# EasyEDA Pro project BLDCv5.eprj

# Schematic Schematic1
Create Date: 2024-09-21; Page Name: P1; Project Name: BLDCv5; Schematic Name: Schematic1; Update Date: 2024-09-21; Company: EasyEDA.com; Drawn: EasyEDA; Page Size: A4; Part Number: JLCPCB-002; Reviewed: EasyEDA; Version: V0.1
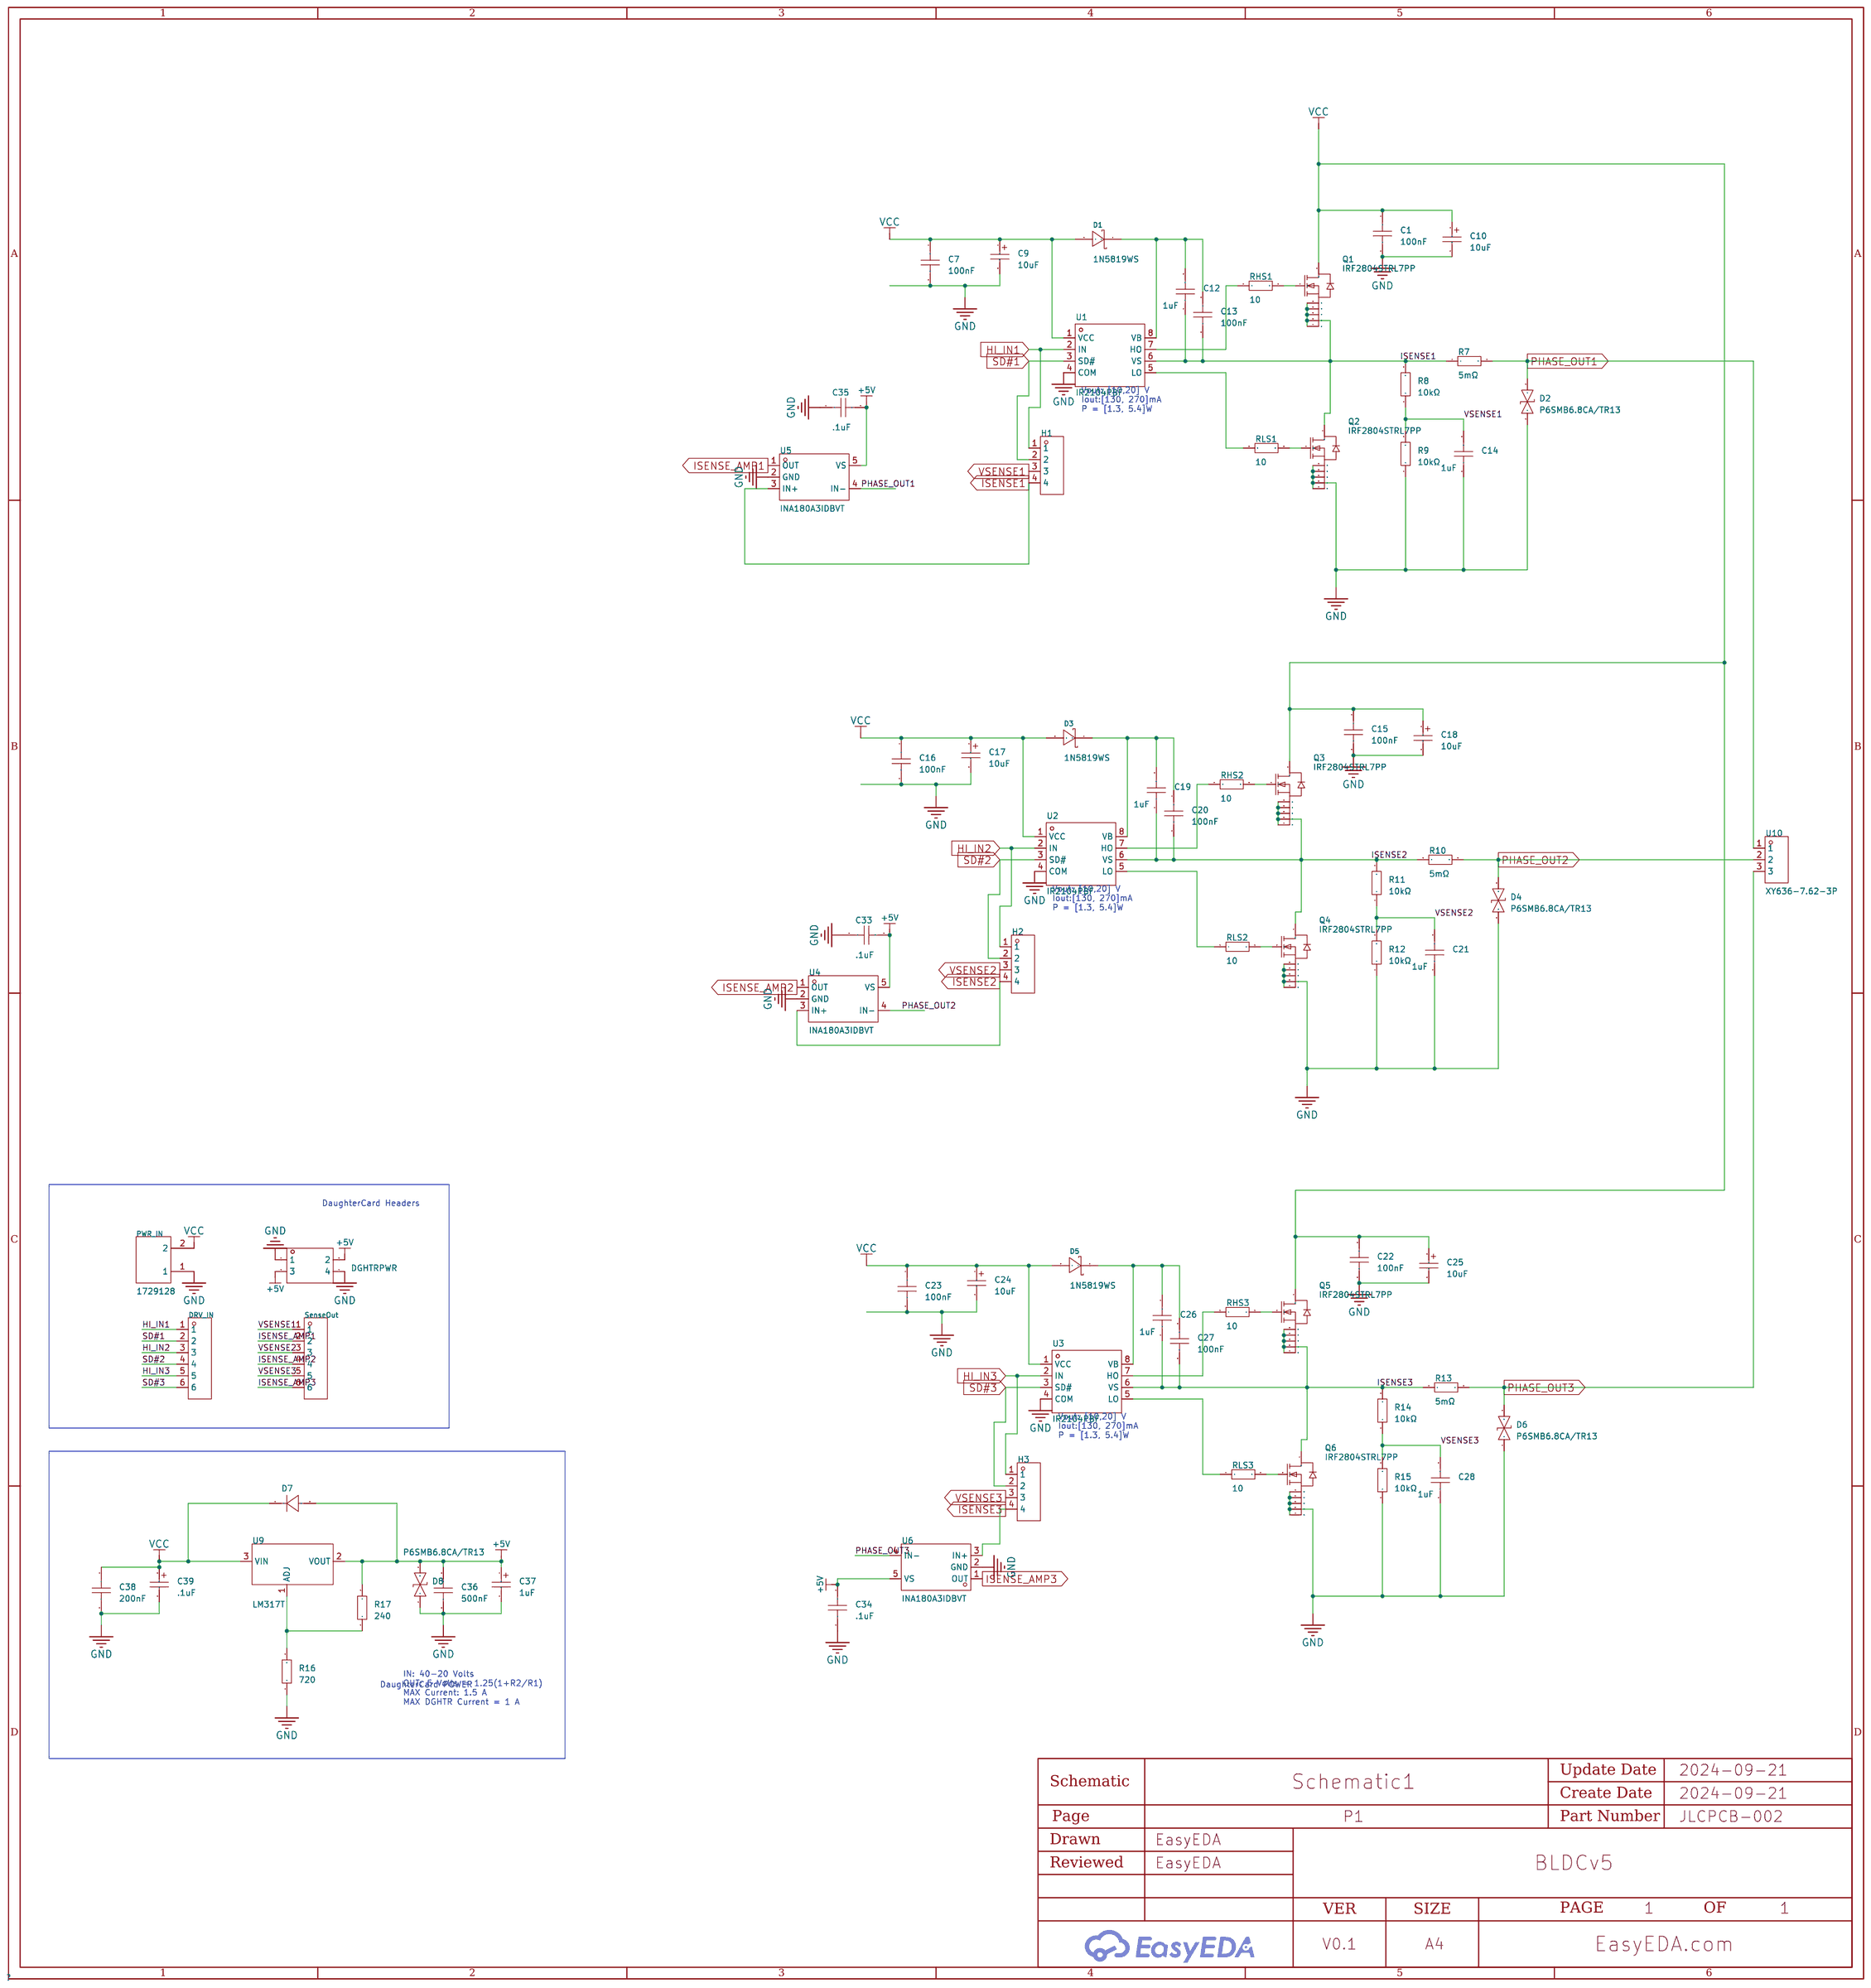
[diagram p0: schematic sheet]

## Parts
C1  100nF  [C0603]
C7  100nF  [C0603]
C9  10uF  [CAP-SMD_BD5.0-L5.3-W5.3-LS6.3-FD]
C10  10uF  [CAP-SMD_BD5.0-L5.3-W5.3-LS6.3-FD]
C12  1uF  [CAP-TH_L7.2-W2.5-P5.00-D0.6]
C13  100nF  [C0603]
C14  1uF  [CAP-TH_L7.2-W2.5-P5.00-D0.6]
C15  100nF  [C0603]
C16  100nF  [C0603]
C17  10uF  [CAP-SMD_BD5.0-L5.3-W5.3-LS6.3-FD]
C18  10uF  [CAP-SMD_BD5.0-L5.3-W5.3-LS6.3-FD]
C19  1uF  [CAP-TH_L7.2-W2.5-P5.00-D0.6]
C20  100nF  [C0603]
C21  1uF  [CAP-TH_L7.2-W2.5-P5.00-D0.6]
C22  100nF  [C0603]
C23  100nF  [C0603]
C24  10uF  [CAP-SMD_BD5.0-L5.3-W5.3-LS6.3-FD]
C25  10uF  [CAP-SMD_BD5.0-L5.3-W5.3-LS6.3-FD]
C26  1uF  [CAP-TH_L7.2-W2.5-P5.00-D0.6]
C27  100nF  [C0603]
C28  1uF  [CAP-TH_L7.2-W2.5-P5.00-D0.6]
C33  .1uF  [C0402]
C34  .1uF  [C0402]
C35  .1uF  [C0402]
C36  500nF  [C0603]
C37  1uF  [CAP-SMD_BD5.0-L5.3-W5.3-LS6.3-FD]
C38  200nF  [C0603]
C39  .1uF  [CAP-SMD_BD5.0-L5.3-W5.3-LS6.3-FD]
D1  1N5819WS  [SOD-323_L1.8-W1.3-LS2.5-RD]
D2  P6SMB6.8CA/TR13  [SMB_L4.6-W3.6-LS5.3-BI]
D3  1N5819WS  [SOD-323_L1.8-W1.3-LS2.5-RD]
D4  P6SMB6.8CA/TR13  [SMB_L4.6-W3.6-LS5.3-BI]
D5  1N5819WS  [SOD-323_L1.8-W1.3-LS2.5-RD]
D6  P6SMB6.8CA/TR13  [SMB_L4.6-W3.6-LS5.3-BI]
D7  -  [DO-41_BD2.4-L4.7-P8.70-D0.9-RD]
D8  P6SMB6.8CA/TR13  [SMB_L4.6-W3.6-LS5.3-BI]
DGHTRPWR  -  [HDR-TH_4P-P2.54-V-F-R2-C2-S2.54]
DRV_IN  -  [HDR-TH_6P-P2.54-V-F]
H1  -  [HDR-TH_4P-P2.54-V-M]
H2  -  [HDR-TH_4P-P2.54-V-M]
H3  -  [HDR-TH_4P-P2.54-V-M]
PWR_IN  1729128  [CONN-TH_2P-P5.08]
Q1  IRF2804STRL7PP  [D2PAK-7_L10.6-W9.6-P1.27-LS15.9-BR]
Q2  IRF2804STRL7PP  [D2PAK-7_L10.6-W9.6-P1.27-LS15.9-BR]
Q3  IRF2804STRL7PP  [D2PAK-7_L10.6-W9.6-P1.27-LS15.9-BR]
Q4  IRF2804STRL7PP  [D2PAK-7_L10.6-W9.6-P1.27-LS15.9-BR]
Q5  IRF2804STRL7PP  [D2PAK-7_L10.6-W9.6-P1.27-LS15.9-BR]
Q6  IRF2804STRL7PP  [D2PAK-7_L10.6-W9.6-P1.27-LS15.9-BR]
R7  5mΩ  [R2512]
R8  10kΩ  [RES-TH_BD3.3-L9.0-P13.00-D0.6]
R9  10kΩ  [RES-TH_BD3.3-L9.0-P13.00-D0.6]
R10  5mΩ  [R2512]
R11  10kΩ  [RES-TH_BD3.3-L9.0-P13.00-D0.6]
R12  10kΩ  [RES-TH_BD3.3-L9.0-P13.00-D0.6]
R13  5mΩ  [R2512]
R14  10kΩ  [RES-TH_BD3.3-L9.0-P13.00-D0.6]
R15  10kΩ  [RES-TH_BD3.3-L9.0-P13.00-D0.6]
R16  720  [RES-TH_BD3.3-L9.0-P13.00-D0.6]
R17  240  [RES-TH_BD3.3-L9.0-P13.00-D0.6]
RHS1  10  [R1210]
RHS2  10  [R1210]
RHS3  10  [R1210]
RLS1  10  [R1210]
RLS2  10  [R1210]
RLS3  10  [R1210]
SenseOut  -  [HDR-TH_6P-P2.54-V-F]
U1  IR2104PBF  [DIP-8_L9.9-W6.6-P2.54-LS7.62-BL]
U2  IR2104PBF  [DIP-8_L9.9-W6.6-P2.54-LS7.62-BL]
U3  IR2104PBF  [DIP-8_L9.9-W6.6-P2.54-LS7.62-BL]
U4  INA180A3IDBVT  [SOT-23-5_L2.9-W1.6-P0.95-LS2.8-TL]
U5  INA180A3IDBVT  [SOT-23-5_L2.9-W1.6-P0.95-LS2.8-TL]
U6  INA180A3IDBVT  [SOT-23-5_L2.9-W1.6-P0.95-LS2.8-TL]
U9  LM317T  [TO-220-3_L10.0-W4.6-P2.54-L]
U10  XY636-7.62-3P  [CONN-TH_XY636-7.62-3P]

## Library data of the parts
C1 C7 C13 C15 C16 C20 C22 C23 C27 C36 C38 = CAP_0603: Supplier Footprint: 0603
C9 C10 C17 C18 C24 C25 C37 C39 = C_Ele_SMD_5x5.4mm: Supplier Footprint: SMD,5x5.4mm
C12 C14 C19 C21 C26 C28 = SMEC334J100M2: Capacitance: Tolerance:±5% Tolerance:±5% Voltage Rated:; LCSC Part Name: 330nF ±5% 100V; Supplier Part: C401104; Manufacturer: CHAMPION(全鹏); Supplier Footprint: 插件,P=5mm; JLCPCB Part Class: Extended Part; Datasheet: https://atta.szlcsc.com/upload/public/pdf/source/20190730/C401104_3330673C3D333BC9993FC47731C2A492.pdf; Supplier: LCSC; Tolerance: ±5%
C33-C35 = CAP_0402: Supplier Part: C1525; Supplier Footprint: 0402
D1 D3 D5 = 1N5819WS_C191023: Forward Voltage (Vf@If):600mV@1A Reverse Voltage (Vr):40V Average Rectified Current (Io):1A; LCSC Part Name: 电压:40V 电流:1A; Supplier Part: C191023; Manufacturer: Hottech(合科泰); Supplier Footprint: SOD-323; JLCPCB Part Class: Basic Part; Datasheet: https://atta.szlcsc.com/upload/public/pdf/source/20220428/3CB86FD8D28D653594B4E35F9D5AEFD9.pdf; Supplier: LCSC; Forward Voltage (Vf@If): 600mV@1A; Reverse Voltage (Vr): 40V; Average Rectified Current (Io): 1A
D2 D4 D6 D8 = P6SMB6.8CA/TR13: Reverse Stand-Off Voltage (Vrwm):5.8V Maximum Clamping Voltage:10.5V Peak Pulse Current (Ipp)@10/1000us:58.1A Peak Pulse Power Dissipation (Ppp)@10/1000us:600W Breakdown Voltage:6.45V Type:TVS; Supplier Part: C78395; Manufacturer: Brightking(君耀电子); Supplier Footprint: SMB(DO-214AA); JLCPCB Part Class: Basic Part; Datasheet: https://atta.szlcsc.com/upload/public/pdf/source/20160709/1468031879762.pdf; Supplier: LCSC; Reverse Stand-Off Voltage (Vrwm): 5.8V; Maximum Clamping Voltage: 10.5V; Peak Pulse Current (Ipp)@10/1000us: 58.1A; Peak Pulse Power Dissipation (Ppp)@10/1000us: 600W; Breakdown Voltage: 6.45V; Type: TVS
D7 = 1N4007: Supplier Footprint: DO-41
DGHTRPWR = HDR-F-2.54_2x2: Supplier Footprint: Through
DRV_IN SenseOut = HDR-F_2.54_1x6P: Supplier Footprint: Through
H1-H3 = HDR-M_2.54_1x4P: Supplier Footprint: Through
PWR_IN = 1729128: Structure:1x2P Pitch:5.08mm Color:Green Mounting Style:Straight Current Rating (Max):13.5A Voltage Rating (Max):400V Number of Pins:2P Number of Rows:1 Wire Gauge - AWG:14~30 Wire Gauge - AWG:14~30 Number of PINs Per Row:2 Operating Temperature Range:- Op; LCSC Part Name: 停产; Supplier Part: C91153; Manufacturer: Phoenix Contact(菲尼克斯); Supplier Footprint: 插件,P=5.08mm; JLCPCB Part Class: Extended Part; Datasheet: https://atta.szlcsc.com/upload/public/pdf/source/20161226/1482720163948.pdf; Supplier: LCSC; Structure: 1x2P; Pitch: 5.08mm; Color: Green; Mounting Style: Straight; Current Rating (Max): 13.5A; Voltage Rating (Max): 400V; Number of Pins: 2P; Number of Rows: 1; Wire Gauge - AWG: 14~30; Number of PINs Per Row: 2
Q1-Q6 = IRF2804STRL7PP: Supplier Part: C459950; Manufacturer: Infineon(英飞凌); Supplier Footprint: TO-252-3; JLCPCB Part Class: Extended Part; Datasheet: https://atta.szlcsc.com/upload/public/pdf/source/20211220/39CD65D483719D465F1A88FFAD2C5DF5.pdf; Supplier: LCSC
R7 R10 R13 = PA2512FKF7W0R005E: Type:Current Sensing Resistors Resistance: Tolerance:±1% Tolerance:±1% Power(Watts): Temperature Coefficient:±100ppm/℃ Temperature Coefficient:±100ppm/℃; LCSC Part Name: 5mΩ ±1% 2W; Supplier Part: C309526; Manufacturer: YAGEO(国巨); Supplier Footprint: 2512; JLCPCB Part Class: Extended Part; Datasheet: https://atta.szlcsc.com/upload/public/pdf/source/20190227/C375693_219964CC8B3EBD36DBDF701587FA5938.pdf; Supplier: LCSC; Type: Current Sensing Resistors; Tolerance: ±1%; Temperature Coefficient: ±100ppm/℃
R8 R9 R11 R12 R14-R17 = Res_AXIAL-1/2W: Supplier Footprint: Through
RHS1-RHS3 RLS1-RLS3 = Res_1210: Supplier Footprint: 1210
U1-U3 = IR2104PBF: Driven Configuration:Half Bridge Load Type:MOSFET；IGBT Number of Drivers:2 Peak Output Current(sink):360mA Peak Output Current(source):210mA Supply Voltage:10V~20V Supply Voltage:10V~20V Rise Time:100ns Fall Time:50ns Operating Temperature:-40℃~+150℃@(Tj); LCSC Part Name: IR2104PBF 停产; Supplier Part: C2959; Manufacturer: Infineon(英飞凌); Supplier Footprint: PDIP-8; JLCPCB Part Class: Extended Part; Datasheet: https://atta.szlcsc.com/upload/public/pdf/source/20140906/1457707236579.pdf; Supplier: LCSC; Driven Configuration: Half Bridge; Load Type: MOSFET；IGBT; Number of Drivers: 2; Peak Output Current(sink): 360mA; Peak Output Current(source): 210mA; Supply Voltage: 10V~20V; Rise Time: 100ns; Fall Time: 50ns; Operating Temperature: -40℃~+150℃@(Tj)
U4-U6 = INA180A3IDBVT: Number of Channels:单路 Supply Current:260uA Operating Temperature:-40℃~+125℃ Operating Temperature:-40℃~+125℃; Supplier Part: C2877844; Manufacturer: TI(德州仪器); Supplier Footprint: SOT-23-5; JLCPCB Part Class: Extended Part; Datasheet: https://www.ti.com/cn/lit/gpn/ina180; Supplier: LCSC; Number of Channels: 单路; Supply Current: 260uA; Operating Temperature: -40℃~+125℃
U9 = LM317T_C5444279: Output Type:可调 Maximum Input Voltage:40V Output Voltage:1.7V~37V Output Voltage:1.7V~37V MAX Output Current:1.5A Output Polarity:Positive electrode Number of Outputs:1; Supplier Part: C5444279; Manufacturer: Siproin(上海矽朋); Supplier Footprint: TO-220; JLCPCB Part Class: Extended Part; Datasheet: https://atta.szlcsc.com/upload/public/pdf/source/20230412/703E44E72FEA4765420A69E1CD3AD9D7.pdf; Supplier: LCSC; Output Type: 可调; Maximum Input Voltage: 40V; Output Voltage: 1.7V~37V; MAX Output Current: 1.5A; Output Polarity: Positive electrode; Number of Outputs: 1
U10 = XY636-7.62-3P: Structure:1x3P Pitch:7.62mm Color:Green Mounting Style:Straight Current Rating (Max):30A Voltage Rating (Max):300V Number of Pins:3P Number of Rows:1 Wire Gauge - AWG:10~26 Wire Gauge - AWG:10~26 Wire Gauge - mm2:4 Wire Gauge - mm2:4 Number of PINs Per Ro; LCSC Part Name: 1x3P 7.62mm 直插 排数:1 每排P数:3; Supplier Part: C880593; Manufacturer: XINLAIYA(新莱亚); Supplier Footprint: 插件,P=7.62mm; JLCPCB Part Class: Extended Part; Datasheet: https://atta.szlcsc.com/upload/public/pdf/source/20201013/C880593_D39E4D9453281D8A65D8CBDFFFF89DB3.pdf; Supplier: LCSC; Structure: 1x3P; Pitch: 7.62mm; Color: Green; Mounting Style: Straight; Current Rating (Max): 30A; Voltage Rating (Max): 300V; Number of Pins: 3P; Number of Rows: 1; Wire Gauge - AWG: 10~26; Wire Gauge - mm2: 4; Number of PINs Per Row: 3; Contact Material: Copper; Contact Plating: Tin; Screw Specification: M3

## Nets
+5V: C33.2 C34.2 C35.2 C36.1 C37.1 D7.2(A) D8.2 DGHTRPWR.2 DGHTRPWR.3 R17.2 U4.5(VS) U5.5(VS) U6.5(VS) U9.2(VOUT)
GND: C1.2 C7.2 C9.2 C10.2 C14.1 C15.2 C16.2 C17.2 C18.2 C21.1 C22.2 C23.2 C24.2 C25.2 C28.1 C33.1 C34.1 C35.1 C36.2 C37.2 C38.2 C39.2 D2.1 D4.1 D6.1 D8.1 DGHTRPWR.1 DGHTRPWR.4 PWR_IN.1 Q2.2(S) Q2.3(S) Q2.5(S) Q2.6(S) Q2.7(S) Q4.2(S) Q4.3(S) Q4.5(S) Q4.6(S) Q4.7(S) Q6.2(S) Q6.3(S) Q6.5(S) Q6.6(S) Q6.7(S) R9.1 R12.1 R15.1 R16.1 U1.4(COM) U2.4(COM) U3.4(COM) U4.2(GND) U5.2(GND) U6.2(GND)
VCC: C1.1 C7.1 C9.1 C10.1 C15.1 C16.1 C17.1 C18.1 C22.1 C23.1 C24.1 C25.1 C38.1 C39.1 D1.2(A) D3.2(A) D5.2(A) D7.1(K) PWR_IN.2 Q1.4(D) Q3.4(D) Q5.4(D) U1.1(VCC) U2.1(VCC) U3.1(VCC) U9.3(VIN)
HI_IN1: DRV_IN.1 H1.1 U1.2(IN)
HI_IN2: DRV_IN.3 H2.1 U2.2(IN)
HI_IN3: DRV_IN.5 H3.1 U3.2(IN)
ISENSE1: C12.1 C13.2 H1.4 Q1.2(S) Q1.3(S) Q1.5(S) Q1.6(S) Q1.7(S) Q2.4(D) R7.1 R8.2 U1.6(VS) U5.3(IN+)
ISENSE2: C19.1 C20.2 H2.4 Q3.2(S) Q3.3(S) Q3.5(S) Q3.6(S) Q3.7(S) Q4.4(D) R10.1 R11.2 U2.6(VS) U4.3(IN+)
ISENSE3: C26.1 C27.2 H3.4 Q5.2(S) Q5.3(S) Q5.5(S) Q5.6(S) Q5.7(S) Q6.4(D) R13.1 R14.2 U3.6(VS) U6.3(IN+)
ISENSE_AMP1: SenseOut.2 U5.1(OUT)
ISENSE_AMP2: SenseOut.4 U4.1(OUT)
ISENSE_AMP3: SenseOut.6 U6.1(OUT)
PHASE_OUT1: D2.2 R7.2 U5.4(IN-) U10.1
PHASE_OUT2: D4.2 R10.2 U4.4(IN-) U10.2
PHASE_OUT3: D6.2 R13.2 U6.4(IN-) U10.3
SD#1: DRV_IN.2 H1.2 U1.3(SD#)
SD#2: DRV_IN.4 H2.2 U2.3(SD#)
SD#3: DRV_IN.6 H3.2 U3.3(SD#)
VSENSE1: C14.2 H1.3 R8.1 R9.2 SenseOut.1
VSENSE2: C21.2 H2.3 R11.1 R12.2 SenseOut.3
VSENSE3: C28.2 H3.3 R14.1 R15.2 SenseOut.5
$1N695: RHS1.1 U1.7(HO)
$1N696: Q1.1(G) RHS1.2
$1N697: RLS1.1 U1.5(LO)
$1N698: Q2.1(G) RLS1.2
$1N719: C12.2 C13.1 D1.1(K) U1.8(VB)
$1N1386: RHS2.1 U2.7(HO)
$1N1387: Q3.1(G) RHS2.2
$1N1388: RLS2.1 U2.5(LO)
$1N1389: Q4.1(G) RLS2.2
$1N1410: C19.2 C20.1 D3.1(K) U2.8(VB)
$1N2077: RHS3.1 U3.7(HO)
$1N2078: Q5.1(G) RHS3.2
$1N2079: RLS3.1 U3.5(LO)
$1N2080: Q6.1(G) RLS3.2
$1N2101: C26.2 C27.1 D5.1(K) U3.8(VB)
$1N11632: R16.2 R17.1 U9.1(ADJ)

## Notes on the sheet
- Vout: [10,20] V
  Iout:[130, 270]mA
  P = [1.3, 5.4]W
- Vout: [10,20] V
  Iout:[130, 270]mA
  P = [1.3, 5.4]W
- DaughterCard Headers
- Vout: [10,20] V
  Iout:[130, 270]mA
  P = [1.3, 5.4]W
- DaughterCard POWER
- IN: 40-20 Volts
  OUT: 5 Volts = 1.25(1+R2/R1)
  MAX Current: 1.5 A
  MAX DGHTR Current = 1 A

# Schematic singlephaseschem
Create Date: 2024-09-21; Page Name: P1; Project Name: BLDC_DRIVER_REUSEPhase; Schematic Name: singlephaseschem; Update Date: 2024-09-21; Company: EasyEDA.com; Drawn: EasyEDA; Page Size: A4; Part Number: JLCPCB-002; Reviewed: EasyEDA; Version: V0.1
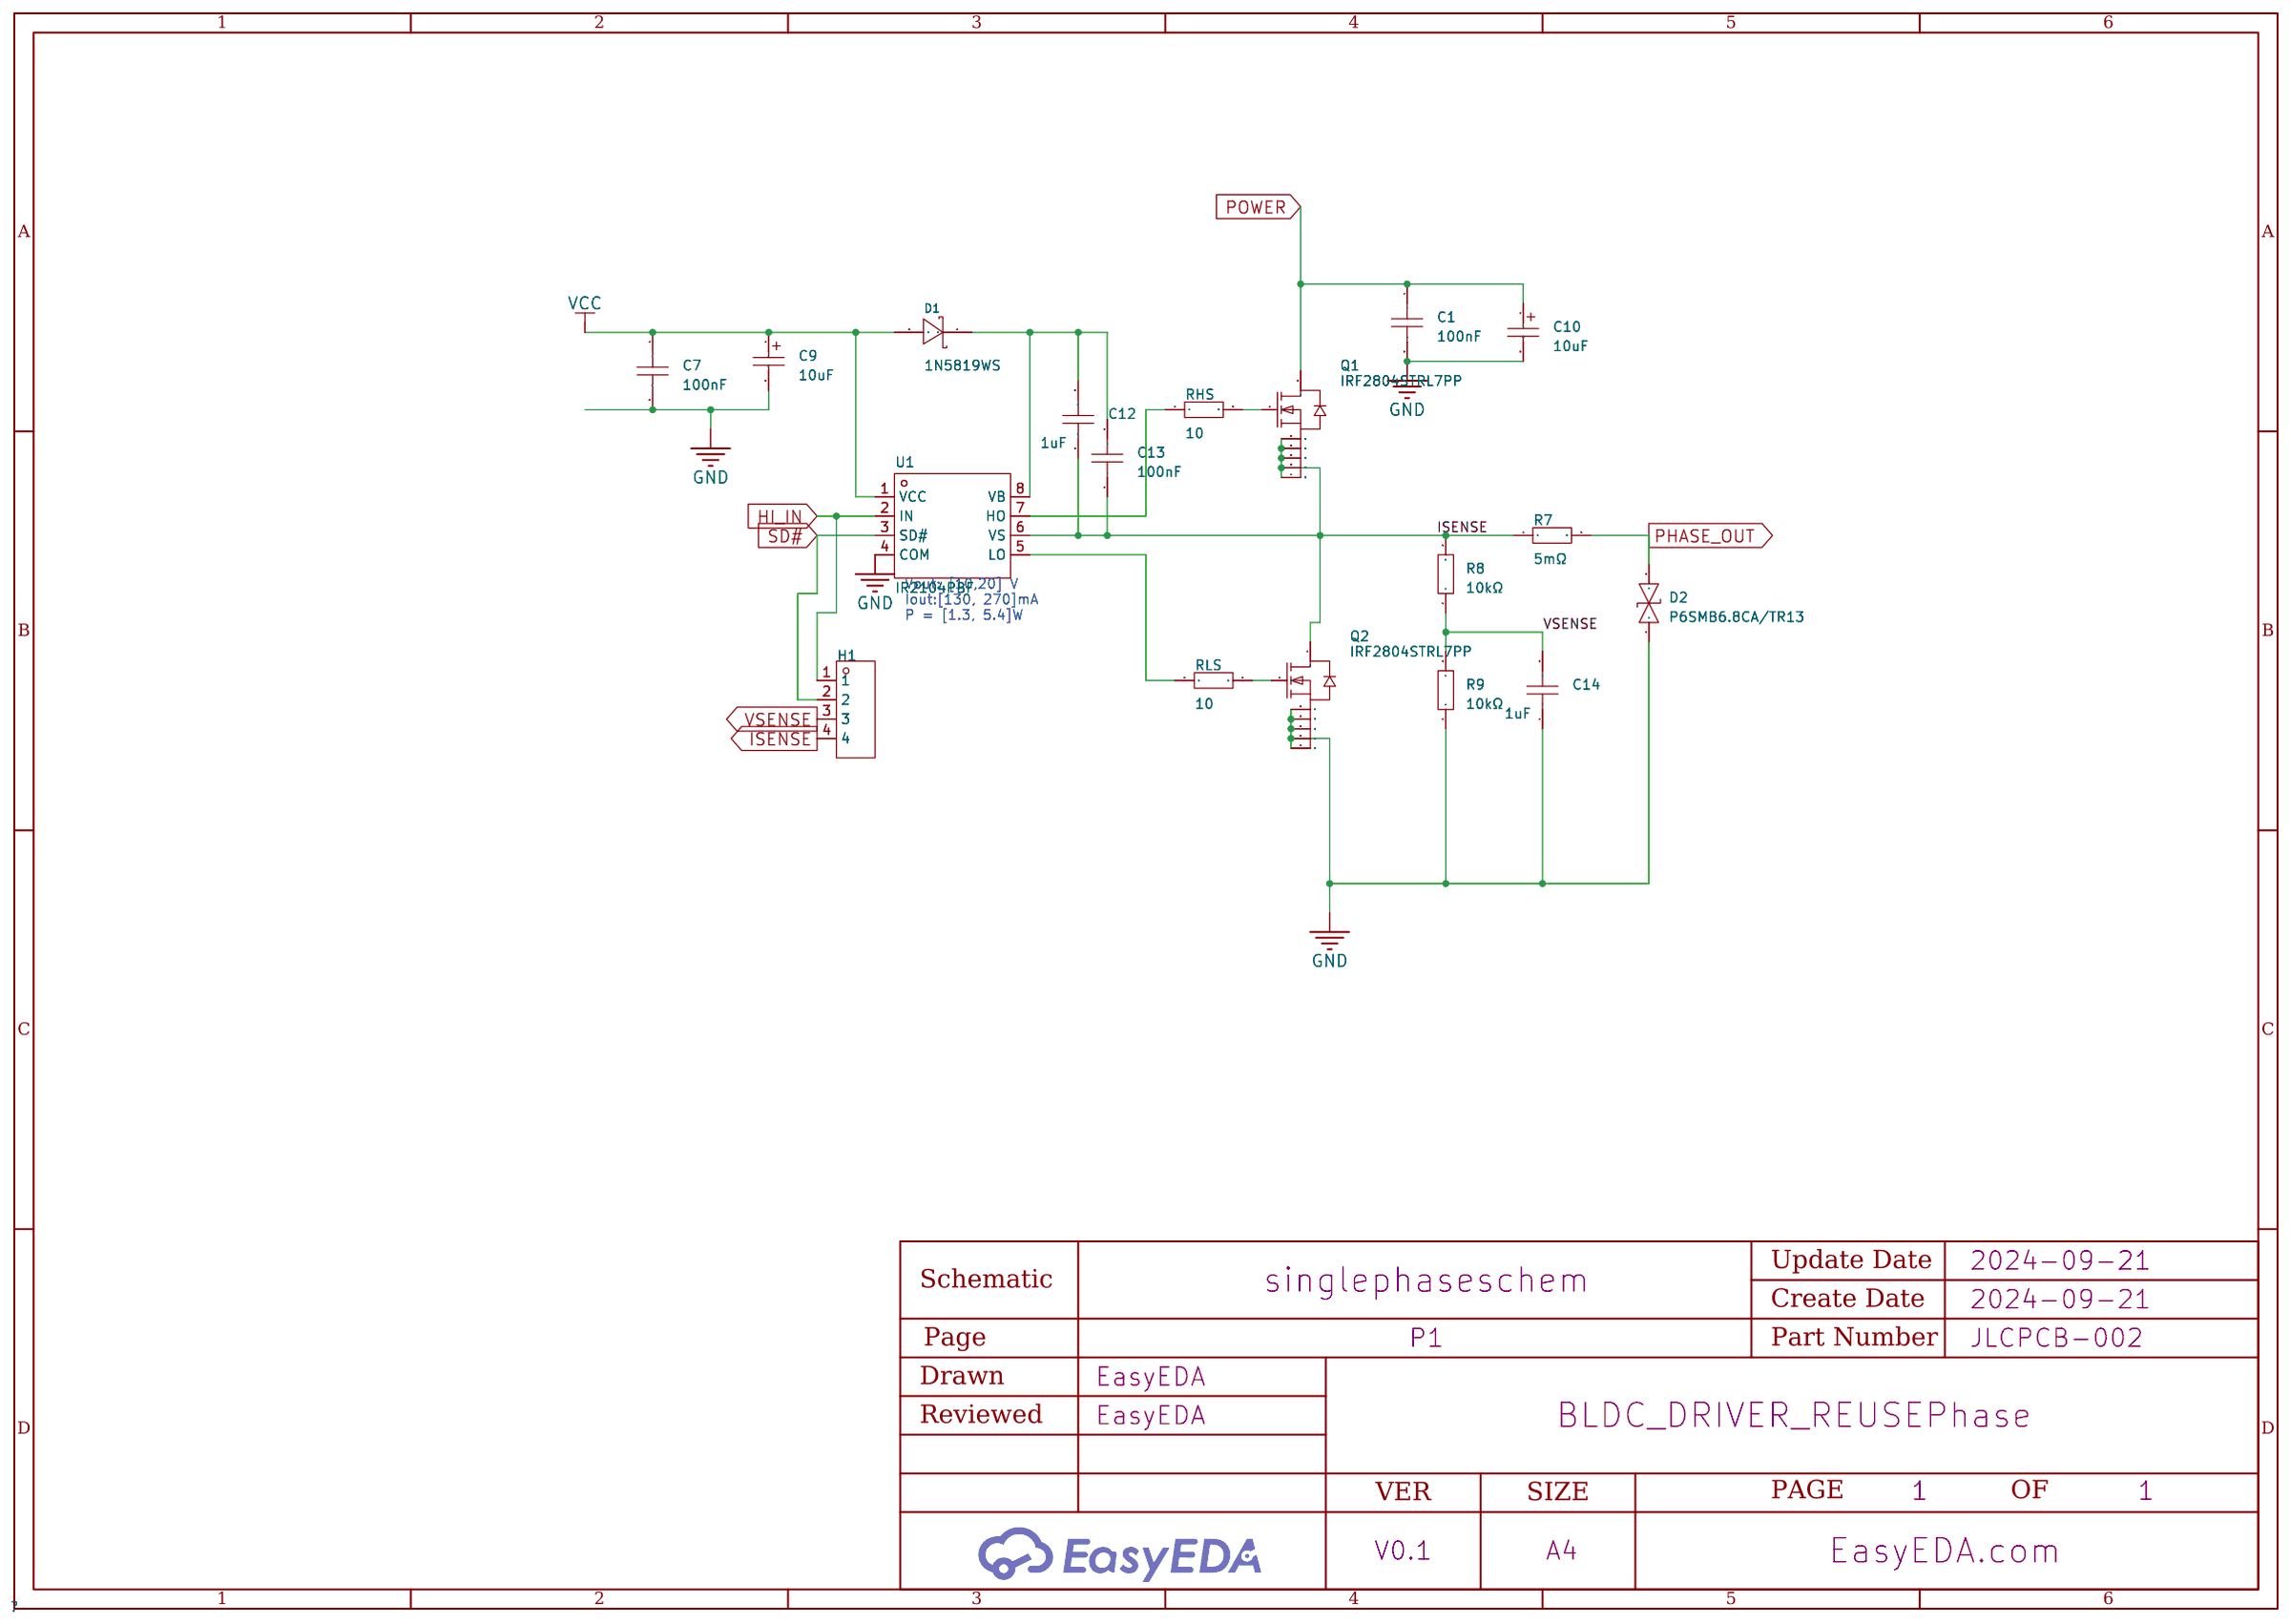
[diagram p1: schematic sheet]

## Parts
C1  100nF  [C0603]
C7  100nF  [C0603]
C9  10uF  [CAP-SMD_BD5.0-L5.3-W5.3-LS6.3-FD]
C10  10uF  [CAP-SMD_BD5.0-L5.3-W5.3-LS6.3-FD]
C12  1uF  [CAP-TH_L7.2-W2.5-P5.00-D0.6]
C13  100nF  [C0603]
C14  1uF  [CAP-TH_L7.2-W2.5-P5.00-D0.6]
D1  1N5819WS  [SOD-323_L1.8-W1.3-LS2.5-RD]
D2  P6SMB6.8CA/TR13  [SMB_L4.6-W3.6-LS5.3-BI]
H1  -  [HDR-TH_4P-P2.54-V-M]
Q1  IRF2804STRL7PP  [D2PAK-7_L10.6-W9.6-P1.27-LS15.9-BR]
Q2  IRF2804STRL7PP  [D2PAK-7_L10.6-W9.6-P1.27-LS15.9-BR]
R7  5mΩ  [R2512]
R8  10kΩ  [RES-TH_BD3.3-L9.0-P13.00-D0.6]
R9  10kΩ  [RES-TH_BD3.3-L9.0-P13.00-D0.6]
RHS  10  [R1210]
RLS  10  [R1210]
U1  IR2104PBF  [DIP-8_L9.9-W6.6-P2.54-LS7.62-BL]

## Library data of the parts
C1 C7 C13 = CAP_0603: Supplier Footprint: 0603
C9 C10 = C_Ele_SMD_5x5.4mm: Supplier Footprint: SMD,5x5.4mm
C12 C14 = SMEC334J100M2: Capacitance: Tolerance:±5% Tolerance:±5% Voltage Rated:; LCSC Part Name: 330nF ±5% 100V; Supplier Part: C401104; Manufacturer: CHAMPION(全鹏); Supplier Footprint: 插件,P=5mm; JLCPCB Part Class: Extended Part; Datasheet: https://atta.szlcsc.com/upload/public/pdf/source/20190730/C401104_3330673C3D333BC9993FC47731C2A492.pdf; Supplier: LCSC; Tolerance: ±5%
D1 = 1N5819WS_C191023: Forward Voltage (Vf@If):600mV@1A Reverse Voltage (Vr):40V Average Rectified Current (Io):1A; LCSC Part Name: 电压:40V 电流:1A; Supplier Part: C191023; Manufacturer: Hottech(合科泰); Supplier Footprint: SOD-323; JLCPCB Part Class: Basic Part; Datasheet: https://atta.szlcsc.com/upload/public/pdf/source/20220428/3CB86FD8D28D653594B4E35F9D5AEFD9.pdf; Supplier: LCSC; Forward Voltage (Vf@If): 600mV@1A; Reverse Voltage (Vr): 40V; Average Rectified Current (Io): 1A
D2 = P6SMB6.8CA/TR13: Reverse Stand-Off Voltage (Vrwm):5.8V Maximum Clamping Voltage:10.5V Peak Pulse Current (Ipp)@10/1000us:58.1A Peak Pulse Power Dissipation (Ppp)@10/1000us:600W Breakdown Voltage:6.45V Type:TVS; Supplier Part: C78395; Manufacturer: Brightking(君耀电子); Supplier Footprint: SMB(DO-214AA); JLCPCB Part Class: Basic Part; Datasheet: https://atta.szlcsc.com/upload/public/pdf/source/20160709/1468031879762.pdf; Supplier: LCSC; Reverse Stand-Off Voltage (Vrwm): 5.8V; Maximum Clamping Voltage: 10.5V; Peak Pulse Current (Ipp)@10/1000us: 58.1A; Peak Pulse Power Dissipation (Ppp)@10/1000us: 600W; Breakdown Voltage: 6.45V; Type: TVS
H1 = HDR-M_2.54_1x4P: Supplier Footprint: Through
Q1 Q2 = IRF2804STRL7PP: Supplier Part: C459950; Manufacturer: Infineon(英飞凌); Supplier Footprint: TO-252-3; JLCPCB Part Class: Extended Part; Datasheet: https://atta.szlcsc.com/upload/public/pdf/source/20211220/39CD65D483719D465F1A88FFAD2C5DF5.pdf; Supplier: LCSC
R7 = PA2512FKF7W0R005E: Type:Current Sensing Resistors Resistance: Tolerance:±1% Tolerance:±1% Power(Watts): Temperature Coefficient:±100ppm/℃ Temperature Coefficient:±100ppm/℃; LCSC Part Name: 5mΩ ±1% 2W; Supplier Part: C309526; Manufacturer: YAGEO(国巨); Supplier Footprint: 2512; JLCPCB Part Class: Extended Part; Datasheet: https://atta.szlcsc.com/upload/public/pdf/source/20190227/C375693_219964CC8B3EBD36DBDF701587FA5938.pdf; Supplier: LCSC; Type: Current Sensing Resistors; Tolerance: ±1%; Temperature Coefficient: ±100ppm/℃
R8 R9 = Res_AXIAL-1/2W: Supplier Footprint: Through
RHS RLS = Res_1210: Supplier Footprint: 1210
U1 = IR2104PBF: Driven Configuration:Half Bridge Load Type:MOSFET；IGBT Number of Drivers:2 Peak Output Current(sink):360mA Peak Output Current(source):210mA Supply Voltage:10V~20V Supply Voltage:10V~20V Rise Time:100ns Fall Time:50ns Operating Temperature:-40℃~+150℃@(Tj); LCSC Part Name: IR2104PBF 停产; Supplier Part: C2959; Manufacturer: Infineon(英飞凌); Supplier Footprint: PDIP-8; JLCPCB Part Class: Extended Part; Datasheet: https://atta.szlcsc.com/upload/public/pdf/source/20140906/1457707236579.pdf; Supplier: LCSC; Driven Configuration: Half Bridge; Load Type: MOSFET；IGBT; Number of Drivers: 2; Peak Output Current(sink): 360mA; Peak Output Current(source): 210mA; Supply Voltage: 10V~20V; Rise Time: 100ns; Fall Time: 50ns; Operating Temperature: -40℃~+150℃@(Tj)

## Nets
GND: C1.2 C7.2 C9.2 C10.2 C14.1 D2.1 Q2.2(S) Q2.3(S) Q2.5(S) Q2.6(S) Q2.7(S) R9.1 U1.4(COM)
VCC: C7.1 C9.1 D1.2(A) U1.1(VCC)
HI_IN: H1.1 U1.2(IN)
ISENSE: C12.1 C13.2 H1.4 Q1.2(S) Q1.3(S) Q1.5(S) Q1.6(S) Q1.7(S) Q2.4(D) R7.1 R8.2 U1.6(VS)
PHASE_OUT: D2.2 R7.2
POWER: C1.1 C10.1 Q1.4(D)
SD#: H1.2 U1.3(SD#)
VSENSE: C14.2 H1.3 R8.1 R9.2
$1N697: RHS.1 U1.7(HO)
$1N698: Q1.1(G) RHS.2
$1N699: RLS.1 U1.5(LO)
$1N700: Q2.1(G) RLS.2
$1N2600: C12.2 C13.1 D1.1(K) U1.8(VB)

## Notes on the sheet
- Vout: [10,20] V
  Iout:[130, 270]mA
  P = [1.3, 5.4]W

# Board PCB1
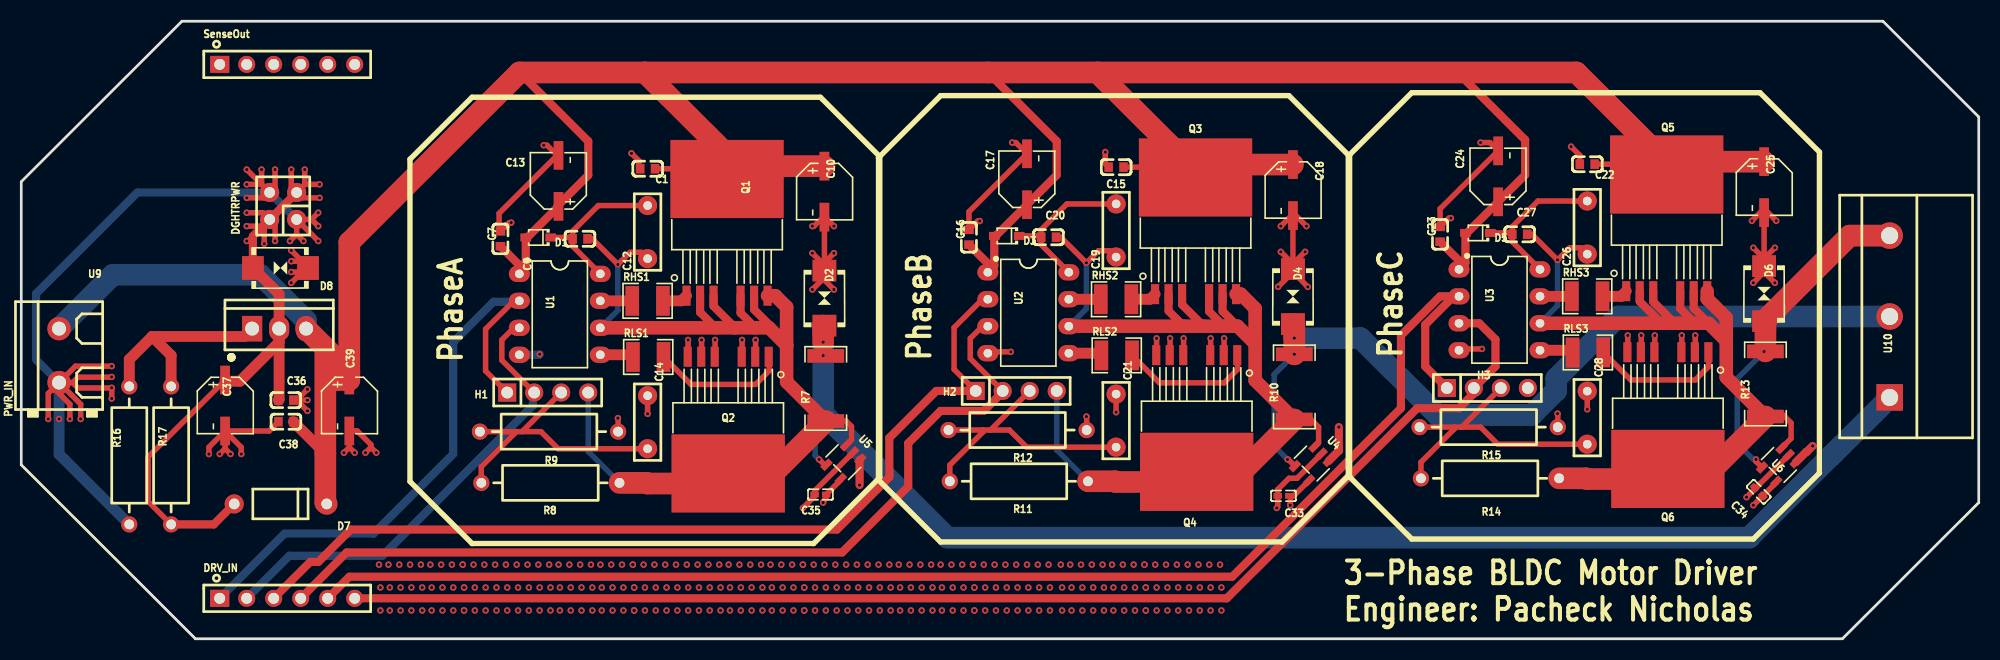
[diagram p2: board, top side]
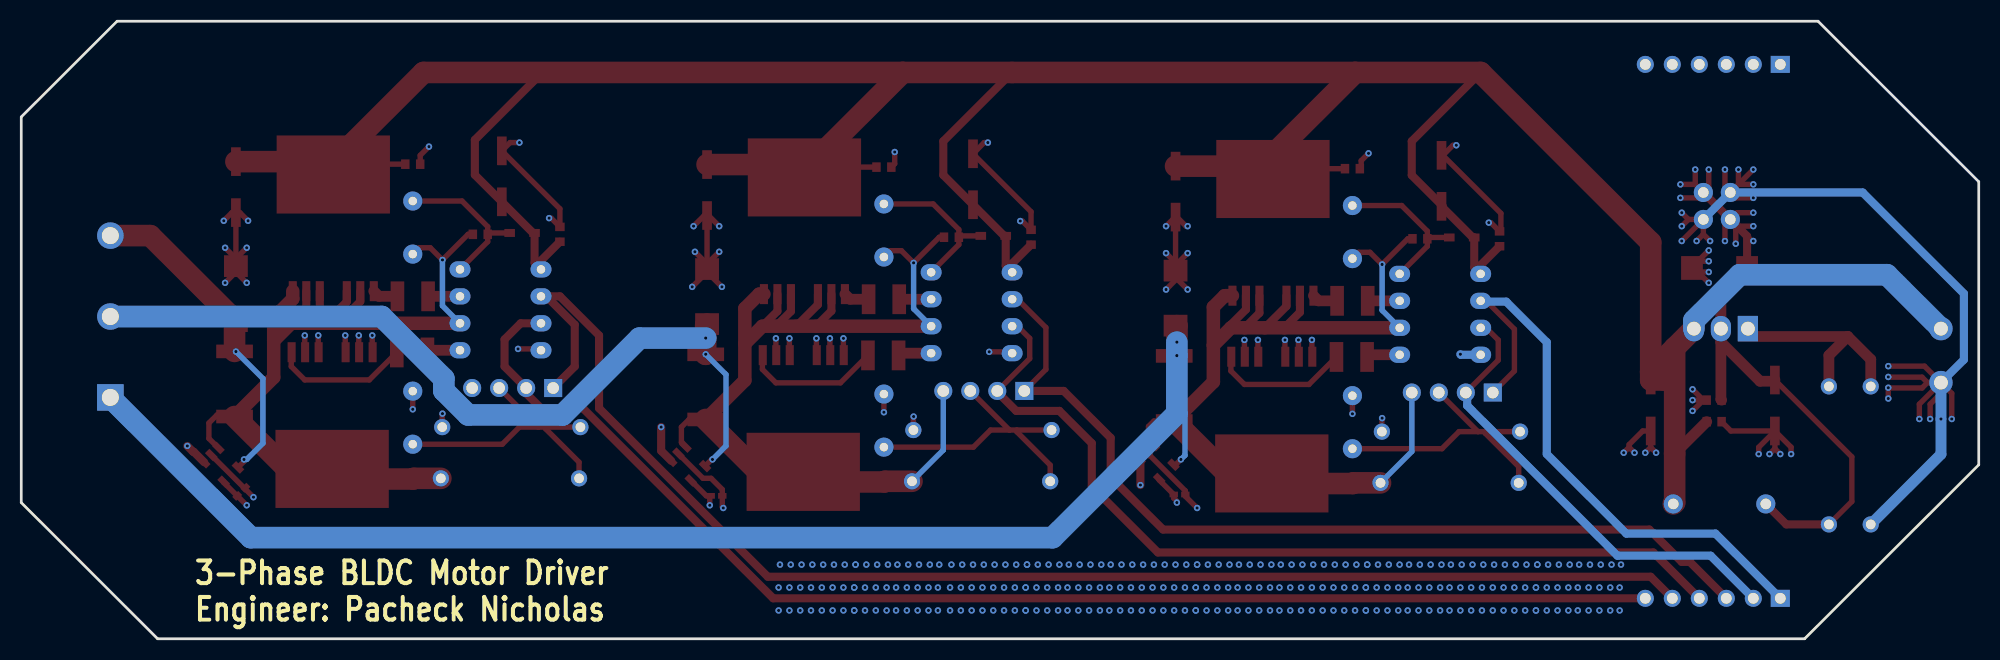
[diagram p3: board, bottom side, seen from below]

Outline 184.15 x 58.17 mm; copper layers: Top Layer, Inner1, Inner2, GND, +5V, Bottom Layer. Coordinates in mm from the lower left corner of the outline.
Outline path: 0,43.05 0,16.38 16.38,0 171.32,0 184.15,12.83 184.15,49.15 175.13,58.17 15.11,58.17 0,43.05
Stack: Top Layer 0.035mm 外层铜厚1oz / Dielectric1 0.0994mm 3313 RC57% 4.2mil / Inner1 0.0152mm 内层铜厚 / Dielectric2 0.55mm 0.55mm H/H不含铜 / Inner2 0.0152mm 内层铜厚 / Dielectric3 0.1088mm 2116 RC54% 4.9mil / GND 0.0152mm 内层铜厚 / Dielectric4 0.55mm 0.55mm H/H不含铜 / +5V 0.0152mm 内层铜厚 / Dielectric5 0.0994mm 3313 RC57% 4.2mil / Bottom Layer 0.035mm 外层铜厚1oz

## Design rules (mm)
template: JLCPCB Capability(Two Layers Board)
spacing copperThickness1oz (default): track to track 0.102, other pairs 0.152 to 0.3
spacing copperThickness2oz: track to track 0.203, other pairs 0.152 to 0.3
track width copperThickness1oz (default): min 0.127, default 0.254, max 2.54
track width copperThickness2oz: min 0.203, default 0.254, max 2.54
differential pair differentialPair (default): width min 0.127, default 0.254, max 2.54; gap min 0.152, default 0.152
via viaSize (default): diameter min 0.5, default 0.61, max 10; hole min 0.3, default 0.305, max 6.3

## Placement (name value [footprint] x y rotation side)
C1  100nF  [C0603]  58.92 44.28 180 top
C7  100nF  [C0603]  45.08 37.67 90 top
C9  10uF  [CAP-SMD_BD5.0-L5.3-W5.3-LS6.3-FD]  50.54 43.13 90 top
C10  10uF  [CAP-SMD_BD5.0-L5.3-W5.3-LS6.3-FD]  75.56 42.12 270 top
C12  1uF  [CAP-TH_L7.2-W2.5-P5.00-D0.6]  58.92 38.31 90 top
C13  100nF  [C0603]  52.57 37.67 0 top
C14  1uF  [CAP-TH_L7.2-W2.5-P5.00-D0.6]  58.92 20.4 270 top
C15  100nF  [C0603]  103 44.43 180 top
C16  100nF  [C0603]  89.15 37.82 90 top
C17  10uF  [CAP-SMD_BD5.0-L5.3-W5.3-LS6.3-FD]  94.61 43.28 90 top
C18  10uF  [CAP-SMD_BD5.0-L5.3-W5.3-LS6.3-FD]  119.63 42.27 270 top
C19  1uF  [CAP-TH_L7.2-W2.5-P5.00-D0.6]  103 38.46 90 top
C20  100nF  [C0603]  96.65 37.82 0 top
C21  1uF  [CAP-TH_L7.2-W2.5-P5.00-D0.6]  103 20.55 270 top
C22  100nF  [C0603]  147.32 44.7 180 top
C23  100nF  [C0603]  133.48 38.1 90 top
C24  10uF  [CAP-SMD_BD5.0-L5.3-W5.3-LS6.3-FD]  138.94 43.56 90 top
C25  10uF  [CAP-SMD_BD5.0-L5.3-W5.3-LS6.3-FD]  163.96 42.54 270 top
C26  1uF  [CAP-TH_L7.2-W2.5-P5.00-D0.6]  147.32 38.73 90 top
C27  100nF  [C0603]  140.97 38.1 0 top
C28  1uF  [CAP-TH_L7.2-W2.5-P5.00-D0.6]  147.32 20.83 270 top
C33  .1uF  [C0402]  118.74 13.46 0 top
C34  .1uF  [C0402]  163.45 13.84 315 top
C35  .1uF  [C0402]  75.18 13.59 0 top
C36  500nF  [C0603]  24.89 22.48 0 top
C37  1uF  [CAP-SMD_BD5.0-L5.3-W5.3-LS6.3-FD]  19.18 21.97 270 top
C38  200nF  [C0603]  24.89 20.45 180 top
C39  .1uF  [CAP-SMD_BD5.0-L5.3-W5.3-LS6.3-FD]  30.86 21.97 270 top
D1  1N5819WS  [SOD-323_L1.8-W1.3-LS2.5-RD]  48.63 37.8 180 top
D2  P6SMB6.8CA/TR13  [SMB_L4.6-W3.6-LS5.3-BI]  75.56 32.08 270 top
D3  1N5819WS  [SOD-323_L1.8-W1.3-LS2.5-RD]  92.71 37.95 180 top
D4  P6SMB6.8CA/TR13  [SMB_L4.6-W3.6-LS5.3-BI]  119.63 32.23 270 top
D5  1N5819WS  [SOD-323_L1.8-W1.3-LS2.5-RD]  137.03 38.22 180 top
D6  P6SMB6.8CA/TR13  [SMB_L4.6-W3.6-LS5.3-BI]  163.96 32.51 270 top
D7  -  [DO-41_BD2.4-L4.7-P8.70-D0.9-RD]  24.38 12.7 180 top
D8  P6SMB6.8CA/TR13  [SMB_L4.6-W3.6-LS5.3-BI]  24.38 34.93 180 top
DGHTRPWR  -  [HDR-TH_4P-P2.54-V-F-R2-C2-S2.54]  24.64 40.77 90 top
DRV_IN  -  [HDR-TH_6P-P2.54-V-F]  25.02 3.81 0 top
H1  -  [HDR-TH_4P-P2.54-V-M]  49.52 23.19 0 top
H2  -  [HDR-TH_4P-P2.54-V-M]  93.6 23.34 0 top
H3  -  [HDR-TH_4P-P2.54-V-M]  137.92 23.62 0 top
PWR_IN  1729128  [CONN-TH_2P-P5.08]  3.56 26.67 90 top
Q1  IRF2804STRL7PP  [D2PAK-7_L10.6-W9.6-P1.27-LS15.9-BR]  66.4 37.81 270 top
Q2  IRF2804STRL7PP  [D2PAK-7_L10.6-W9.6-P1.27-LS15.9-BR]  66.51 21.07 90 top
Q3  IRF2804STRL7PP  [D2PAK-7_L10.6-W9.6-P1.27-LS15.9-BR]  110.47 37.96 270 top
Q4  IRF2804STRL7PP  [D2PAK-7_L10.6-W9.6-P1.27-LS15.9-BR]  110.58 21.22 90 top
Q5  IRF2804STRL7PP  [D2PAK-7_L10.6-W9.6-P1.27-LS15.9-BR]  154.8 38.23 270 top
Q6  IRF2804STRL7PP  [D2PAK-7_L10.6-W9.6-P1.27-LS15.9-BR]  154.91 21.49 90 top
R7  5mΩ  [R2512]  75.69 23.58 90 top
R8  10kΩ  [RES-TH_BD3.3-L9.0-P13.00-D0.6]  49.78 14.69 0 top
R9  10kΩ  [RES-TH_BD3.3-L9.0-P13.00-D0.6]  49.65 19.51 180 top
R10  5mΩ  [R2512]  119.76 23.72 90 top
R11  10kΩ  [RES-TH_BD3.3-L9.0-P13.00-D0.6]  93.85 14.83 0 top
R12  10kΩ  [RES-TH_BD3.3-L9.0-P13.00-D0.6]  93.73 19.66 180 top
R13  5mΩ  [R2512]  164.08 24 90 top
R14  10kΩ  [RES-TH_BD3.3-L9.0-P13.00-D0.6]  138.18 15.11 0 top
R15  10kΩ  [RES-TH_BD3.3-L9.0-P13.00-D0.6]  138.05 19.94 180 top
R16  720  [RES-TH_BD3.3-L9.0-P13.00-D0.6]  10.16 17.27 90 top
R17  240  [RES-TH_BD3.3-L9.0-P13.00-D0.6]  14.1 17.27 270 top
RHS1  10  [R1210]  58.92 31.83 0 top
RHS2  10  [R1210]  103 31.98 0 top
RHS3  10  [R1210]  147.32 32.26 0 top
RLS1  10  [R1210]  58.98 26.54 0 top
RLS2  10  [R1210]  103.06 26.69 0 top
RLS3  10  [R1210]  147.38 26.97 0 top
SenseOut  -  [HDR-TH_6P-P2.54-V-F]  25.02 54.1 0 top
U1  IR2104PBF  [DIP-8_L9.9-W6.6-P2.54-LS7.62-BL]  50.67 30.56 270 top
U2  IR2104PBF  [DIP-8_L9.9-W6.6-P2.54-LS7.62-BL]  94.74 30.71 270 top
U3  IR2104PBF  [DIP-8_L9.9-W6.6-P2.54-LS7.62-BL]  139.06 30.99 270 top
U4  INA180A3IDBVT  [SOT-23-5_L2.9-W1.6-P0.95-LS2.8-TL]  121.41 16.51 225 top
U5  INA180A3IDBVT  [SOT-23-5_L2.9-W1.6-P0.95-LS2.8-TL]  77.34 16.64 225 top
U6  INA180A3IDBVT  [SOT-23-5_L2.9-W1.6-P0.95-LS2.8-TL]  165.35 16.38 225 top
U9  LM317T  [TO-220-3_L10.0-W4.6-P2.54-L]  24.26 29.21 0 top
U10  XY636-7.62-3P  [CONN-TH_XY636-7.62-3P]  175.77 30.35 90 top

## Footprints (pads in the part's own frame, mm; a bottom-side part is the same pattern mirrored in y, then rotated)
C0402
  rect 0.79x0.54 smd: 1(-0.545,0) 2(0.545,0)
C0603
  rect 0.8x0.9 smd: 1(-0.7,0) 2(0.7,0)
CAP-SMD_BD5.0-L5.3-W5.3-LS6.3-FD
  rect 2.7x0.91 smd: 1(-2.4,0) 2(2.4,0)
CAP-TH_L7.2-W2.5-P5.00-D0.6
  round 1.8 hole 0.8: 1(-2.499,0) 2(2.499,0)
CONN-TH_2P-P5.08
  round 2.2 hole 1.3: 1(-2.54,0) 2(2.54,0)
CONN-TH_XY636-7.62-3P
  rect 2.5x2.5 hole 1.6: 1(-7.62,0)
  round 2.5 hole 1.6: 2(0,0) 3(7.62,0)
D2PAK-7_L10.6-W9.6-P1.27-LS15.9-BR
  rect 1.887x0.762 smd: 1(5.495,-3.81) 2(5.495,-2.54) 3(5.495,-1.27) 5(5.495,1.27) 6(5.495,2.54) 7(5.495,3.81)
  rect 7.356x10.66 smd: 4(-5.495,0)
DIP-8_L9.9-W6.6-P2.54-LS7.62-BL
  oval 1.524x1.97 hole 0.8: 1(-3.81,-3.81) 2(-1.27,-3.81) 3(1.27,-3.81) 4(3.81,-3.81) 5(3.81,3.81) 6(1.27,3.81) 7(-1.27,3.81) 8(-3.81,3.81)
DO-41_BD2.4-L4.7-P8.70-D0.9-RD
  round 1.8 hole 1: 1(-4.35,0) 2(4.35,0)
HDR-TH_4P-P2.54-V-F-R2-C2-S2.54
  round 1.8 hole 1: 1(-1.27,-1.27) 2(-1.27,1.27) 3(1.27,-1.27) 4(1.27,1.27)
HDR-TH_4P-P2.54-V-M
  rect 1.7x1.7 hole 1.1: 1(-3.81,0)
  round 1.7 hole 1.1: 2(-1.27,0) 3(1.27,0) 4(3.81,0)
HDR-TH_6P-P2.54-V-F
  rect 1.8x1.6 hole 1.02: 1(-6.35,0)
  round 1.6 hole 1.02: 2(-3.81,0) 3(-1.27,0) 4(1.27,0) 5(3.81,0) 6(6.35,0)
R1210
  rect 1.282x2.808 smd: 1(-1.441,0) 2(1.441,0)
R2512
  rect 1.282x3.456 smd: 1(-3.067,0) 2(3.067,0)
RES-TH_BD3.3-L9.0-P13.00-D0.6
  round 1.524 hole 0.914: 1(-6.5,0) 2(6.5,0)
SMB_L4.6-W3.6-LS5.3-BI
  rect 2.047x2.241 smd: 1(-2.591,0) 2(2.591,0)
SOD-323_L1.8-W1.3-LS2.5-RD
  rect 1x0.75 smd: 1(-1.173,0) 2(1.173,0)
SOT-23-5_L2.9-W1.6-P0.95-LS2.8-TL
  rect 1.1x0.6 smd: 1(-1.3,0.95) 2(-1.3,0) 3(-1.3,-0.95) 4(1.3,-0.95) 5(1.3,0.95)
TO-220-3_L10.0-W4.6-P2.54-L
  rect 1.9x2.4 hole 1.3: 1(-2.54,0)
  oval 1.9x2.4 hole 1.3: 2(0,0) 3(2.54,0)

## Nets
As in the schematic.

## Via types
v1: diameter 0.61, hole 0.305, Top Layer to Bottom Layer, 368 vias

## Routing (per net, layer and track width the routed paths; a pad name or vN(x,y) marks a point on that pad's centre or on a via; arc(x,y) is an arc through that point)
+5V: length 79.8
  Top Layer w0.508: DGHTRPWR.3 26.42,41.53 v1(28.07,41.53) ; DGHTRPWR.3 25.4,42.55 v1(25.4,44.2) ; DGHTRPWR.3 26.67,42.8 ; 22.73,38.86 v1(21.21,38.86) ; v1(26.67,44.2) 26.67,42.8 ; 26.67,42.8 v1(28.07,42.8) ; v1(23.88,37.47) 23.88,38.99 DGHTRPWR.2 22.73,40.13 v1(21.21,40.13) ; 165.11,14.79 165.11,14.73 C34.2 163.83,13.46 v1(162.94,12.57) ; U5.5 77.1,14.96 C35.2 75.73,13.25 75.44,12.95 v1(75.44,12.83) ; v1(21.21,37.47) 21.34,37.47 21.79,37.92 ; R17.2 11.94,12.93 11.94,17.13 C37.1 ; U4.5 119.71,13.46 C33.2 119.38,13.37 v1(119.38,12.57) ; 22.61,38.74 22.86,38.48 v1(22.86,37.21)
  Top Layer w0.762: R17.2 18.11,10.77 D7.2 ; D8.2 21.79,37.92 DGHTRPWR.2 DGHTRPWR.3
  Top Layer w1.016: C37.1 19.29,24.26 20.57,24.26 24.26,27.94 ; 24.26,27.94 U9.2 24.26,32.46 D8.2 ; 24.26,27.94 24.26,22.54 C36.1
GND: length 281.1
  Top Layer w0.508: v1(2.54,20.7) 2.54,23.11 PWR_IN.1 ; D8.1 26.98,35 v1(25.4,36.58) ; D8.1 26.34,35.56 v1(25.4,35.56) ; D8.1 26.8,34.93 26.42,34.54 ; 25.91,38.1 v1(25.27,37.47) ; 25.91,38.1 DGHTRPWR.1 ; 25.91,38.1 v1(26.54,37.47) ; C37.2 23.32,19.57 C38.2 ; C37.2 17.65,18.05 v1(17.65,17.4) ; C37.2 19.18,19.56 ; v1(21.21,41.53) 22.86,41.53 DGHTRPWR.4 ; 32.89,18.03 v1(33.4,17.53) ; 32.89,18.03 v1(32.39,17.53) ; 32.89,18.03 32.89,18.29 31.61,19.57 C39.2 30.86,18.03 ; C10.2 75.43,39.72 74.58,38.86 v1(74.42,38.86) ; C10.2 75.6,39.72 v1(76.45,38.86) ; C10.2 75.56,35.43 ; 44.95,38.37 44.95,40.07 50.41,45.53 49.46,46.48 v1(49.15,46.48) ; v1(153.67,28.57) 153.67,27.03 Q6.5 ; Q2.2 69.08,26.6 v1(69.08,28.15) ; 75.56,35.43 v1(76.45,36.32) ; 75.56,35.43 75.43,35.3 ; 75.56,35.43 75.56,35.31 ; v1(22.61,44.2) 22.61,42.8 ; 22.61,42.8 v1(21.21,42.8) ; 22.61,42.8 v1(21.21,44.2) ; 22.61,42.8 DGHTRPWR.4 ; v1(8.51,22.63) v1(8.51,23.65) 8.49,23.62 5.33,23.62 4.83,24.13 ; DGHTRPWR.4 23.88,42.55 v1(23.88,44.2) ; 119.63,35.31 D4.1 119.63,34.54 ; 119.63,35.31 119.63,39.87 ; 119.63,35.31 v1(118.49,36.45) ; 119.63,35.31 v1(120.78,36.45) ; 119.63,39.87 119.9,39.87 v1(120.9,38.86) ; 119.63,39.87 119.49,39.87 v1(118.49,38.86) ; PWR_IN.1 5.59,22.1 v1(5.59,20.7) ; PWR_IN.1 4.83,24.13 ; PWR_IN.1 5.1,25.68 v1(8.51,25.68) ; v1(162.31,13.34) 163.06,14.09 C34.1 163.2,14.23 U6.2 ; U2.4 91.06,27.03 v1(93.09,27.03) ; v1(57.4,45.72) 58.09,45.03 58.09,44.28 ; C15.2 101.98,44.74 v1(101.98,45.85) ; R15.1 144.55,21.18 v1(144.53,21.21) ; v1(74.42,32.89) 75.43,33.9 75.43,33.92 ; v1(103,21.34) C21.1 ; v1(18.67,17.4) 19.18,17.91 ; 19.18,17.91 19.18,19.56 ; 19.18,17.91 v1(19.69,17.4) ; v1(25.4,33.53) 26.42,34.54 ; 26.42,34.54 v1(25.4,34.54) ; v1(8.51,24.66) 8.49,24.64 5.33,24.64 4.83,24.13 ; v1(64,28.15) 64,26.6 Q2.6 ; R12.1 100.23,20.91 v1(100.2,20.93) ; Q6.7 151.13,27.03 v1(151.13,28.57) ; v1(137.29,46.74) 138.16,46.74 C24.2 133.48,40.5 C23.2 134.3,39.62 v1(134.49,39.62) ; U3.4 135.38,27.3 v1(137.41,27.3) ; 108.04,26.71 108.08,26.75 v1(108.08,28.3) ; 163.96,34.54 163.96,35.81 ; 163.96,34.54 v1(164.97,33.53) ; 163.96,34.54 v1(162.94,33.53) ; Q2.3 67.81,26.6 v1(67.81,28.15) ; 75.43,33.92 v1(76.45,32.89) ; 75.43,33.92 75.43,35.3 ; v1(109.35,28.3) 109.35,26.75 109.31,26.71 ; C7.2 45.9,39.2 v1(46.09,39.2) ; 163.96,35.81 v1(162.94,36.83) ; 163.96,35.81 v1(164.97,36.83) ; 163.96,35.81 C25.2 ; v1(65.27,28.15) 65.27,26.6 Q2.5 ; v1(30.35,17.53) 30.86,18.03 ; 30.86,18.03 v1(31.37,17.53) ; 27.3,39.5 v1(27.94,38.86) ; 27.3,39.5 DGHTRPWR.1 ; 27.3,39.5 v1(27.94,40.13) ; 19.18,19.56 20.7,18.03 v1(20.7,17.4) ; v1(152.4,28.57) 152.4,27.03 Q6.6 ; v1(62.73,28.15) 62.73,26.6 Q2.7 ; v1(73.53,12.32) 74.64,13.43 C35.1 74.64,13.93 78.26,17.56 ; 119.63,34.54 v1(118.24,33.15) ; 119.63,34.54 v1(121.03,33.15) ; 75.43,35.3 75.43,35.31 v1(74.42,36.32) ; v1(156.21,28.57) 156.21,27.03 Q6.3 ; v1(56.13,20.78) 56.15,20.76 R9.1 ; DGHTRPWR.1 v1(27.94,37.47) ; v1(58.92,21.19) C14.1 ; C22.2 146.62,45.53 v1(145.8,46.36) ; v1(162.81,39.37) 163.59,40.14 C25.2 ; v1(157.48,28.57) 157.48,27.03 Q6.2 ; v1(147.32,21.61) 147.32,23.32 ; C25.2 164.33,40.14 v1(165.1,39.37) ; 111.85,26.71 111.89,26.75 v1(111.89,28.3) ; v1(4.57,20.7) 4.57,22.1 3.56,23.11 ; v1(26.92,23.5) 25.91,22.48 ; 25.91,22.48 v1(26.92,21.46) ; 25.91,22.48 v1(26.92,22.48) ; 25.91,22.48 C36.2 ; U4.2 120.02,15.11 119.25,15.11 118.2,14.06 C33.1 118.2,12.41 v1(118.11,12.32) ; v1(106.81,28.3) 106.81,26.75 106.77,26.71 ; v1(93.22,46.74) 93.56,46.74 C17.2 89.15,40.22 C16.2 89.98,39.35 v1(90.17,39.35) ; 113.12,26.71 113.16,26.75 v1(113.16,28.3)
  Bottom Layer w0.762: PWR_IN.1 1.4,26.29 1.4,32.51 10.92,42.04 DGHTRPWR.4 DGHTRPWR.1 ; v1(48.77,26.8) 48.72,26.75 U1.4
  Bottom Layer w1.016: R16.1 3.56,17.38 v1(3.56,20.7) PWR_IN.1
  vias: v1(33.66,6.99) v1(33.78,4.83) v1(33.78,2.67) v1(34.54,6.99) v1(34.67,4.83) v1(34.67,2.67) v1(35.56,6.99) v1(35.69,4.83) v1(35.69,2.67) v1(36.58,6.99) v1(36.7,4.83) v1(36.7,2.67) v1(37.59,6.99) v1(37.72,4.83) v1(37.72,2.67) v1(38.48,6.99) v1(38.61,4.83) v1(38.61,2.67) v1(39.5,6.99) v1(39.62,4.83) v1(39.62,2.67) v1(40.51,6.99) v1(40.64,4.83) v1(40.64,2.67) v1(41.53,6.99) v1(41.53,6.99) v1(41.66,4.83) v1(41.66,4.83) v1(41.66,2.67) v1(41.66,2.67) v1(42.55,6.99) v1(42.67,4.83) v1(42.67,2.67) v1(43.56,6.99) v1(43.69,4.83) v1(43.69,2.67) v1(44.58,6.99) v1(44.7,4.83) v1(44.7,2.67) v1(45.59,6.99) v1(45.72,4.83) v1(45.72,2.67) v1(46.61,6.99) v1(46.74,4.83) v1(46.74,2.67) v1(47.62,6.99) v1(47.75,4.83) v1(47.75,2.67) v1(48.64,6.99) v1(48.77,4.83) v1(48.77,2.67) v1(49.66,6.99) v1(49.78,4.83) v1(49.78,2.67) v1(50.55,6.99) v1(50.67,4.83) v1(50.67,2.67) v1(51.56,6.99) v1(51.69,4.83) v1(51.69,2.67) v1(52.58,6.99) v1(52.7,4.83) v1(52.7,2.67) v1(53.59,6.99) v1(53.72,4.83) v1(53.72,2.67) v1(54.48,6.99) v1(54.61,4.83) v1(54.61,2.67) v1(55.5,6.99) v1(55.63,4.83) v1(55.63,2.67) v1(56.52,6.99) v1(56.64,4.83) v1(56.64,2.67) v1(57.53,6.99) v1(57.53,6.99) v1(57.66,4.83) v1(57.66,4.83) v1(57.66,2.67) v1(57.66,2.67) v1(58.55,6.99) v1(58.67,4.83) v1(58.67,2.67) v1(59.56,6.99) v1(59.69,4.83) v1(59.69,2.67) v1(60.58,6.99) v1(60.71,4.83) v1(60.71,2.67) v1(61.59,6.99) v1(61.72,4.83) v1(61.72,2.67) v1(62.61,6.99) v1(62.74,4.83) v1(62.74,2.67) v1(63.63,6.99) v1(63.75,4.83) v1(63.75,2.67) v1(64.64,6.99) v1(64.77,4.83) v1(64.77,2.67) v1(65.66,6.99) v1(65.79,4.83) v1(65.79,2.67) v1(66.55,6.99) v1(66.67,4.83) v1(66.67,2.67) v1(67.56,6.99) v1(67.69,4.83) v1(67.69,2.67) v1(68.58,6.99) v1(68.71,4.83) v1(68.71,2.67) v1(69.6,6.99) v1(69.72,4.83) v1(69.72,2.67) v1(70.48,6.99) v1(70.61,4.83) v1(70.61,2.67) v1(71.5,6.99) v1(71.63,4.83) v1(71.63,2.67) v1(72.52,6.99) v1(72.64,4.83) v1(72.64,2.67) v1(73.53,6.99) v1(73.53,6.99) v1(73.66,4.83) v1(73.66,4.83) v1(73.66,2.67) v1(73.66,2.67) v1(74.55,6.99) v1(74.68,4.83) v1(74.68,2.67) v1(75.56,6.99) v1(75.69,4.83) v1(75.69,2.67) v1(76.58,6.99) v1(76.71,4.83) v1(76.71,2.67) v1(77.6,6.99) v1(77.72,4.83) v1(77.72,2.67) v1(78.61,6.99) v1(78.74,4.83) v1(78.74,2.67) v1(79.63,6.99) v1(79.76,4.83) v1(79.76,2.67) v1(80.64,6.99) v1(80.77,4.83) v1(80.77,2.67) v1(81.66,6.99) v1(81.79,4.83) v1(81.79,2.67) v1(82.55,6.99) v1(82.68,4.83) v1(82.68,2.67) v1(83.57,6.99) v1(83.69,4.83) v1(83.69,2.67) v1(84.58,6.99) v1(84.71,4.83) v1(84.71,2.67) v1(85.6,6.99) v1(85.73,4.83) v1(85.73,2.67) v1(86.49,6.99) v1(86.61,4.83) v1(86.61,2.67) v1(87.5,6.99) v1(87.63,4.83) v1(87.63,2.67) v1(88.52,6.99) v1(88.65,4.83) v1(88.65,2.67) v1(89.54,6.99) v1(89.54,6.99) v1(89.66,4.83) v1(89.66,4.83) v1(89.66,2.67) v1(89.66,2.67) v1(90.55,6.99) v1(90.68,4.83) v1(90.68,2.67) v1(91.57,6.99) v1(91.69,4.83) v1(91.69,2.67) v1(92.58,6.99) v1(92.71,4.83) v1(92.71,2.67) v1(93.6,6.99) v1(93.73,4.83) v1(93.73,2.67) v1(94.61,6.99) v1(94.74,4.83) v1(94.74,2.67) v1(95.63,6.99) v1(95.76,4.83) v1(95.76,2.67) v1(96.65,6.99) v1(96.77,4.83) v1(96.77,2.67) v1(97.79,6.99) v1(97.92,4.83) v1(97.92,2.67) v1(98.68,6.99) v1(98.81,4.83) v1(98.81,2.67) v1(99.7,6.99) v1(99.82,4.83) v1(99.82,2.67) v1(100.71,6.99) v1(100.84,4.83) v1(100.84,2.67) v1(101.73,6.99) v1(101.85,4.83) v1(101.85,2.67) v1(102.62,6.99) v1(102.74,4.83) v1(102.74,2.67) v1(103.63,6.99) v1(103.76,4.83) v1(103.76,2.67) v1(104.65,6.99) v1(104.77,4.83) v1(104.77,2.67) v1(105.66,6.99) v1(105.66,6.99) v1(105.79,4.83) v1(105.79,4.83) v1(105.79,2.67) v1(105.79,2.67) v1(106.68,6.99) v1(106.81,4.83) v1(106.81,2.67) v1(107.7,6.99) v1(107.82,4.83) v1(107.82,2.67) v1(108.71,6.99) v1(108.84,4.83) v1(108.84,2.67) v1(109.73,6.99) v1(109.86,4.83) v1(109.86,2.67) v1(110.74,6.99) v1(110.87,4.83) v1(110.87,2.67) v1(111.76,6.99) v1(111.89,4.83) v1(111.89,2.67) v1(112.78,6.99) v1(112.9,4.83) v1(112.9,2.67)
VCC: length 369.2
  Top Layer w0.508: C22.1 153.83,44.7 Q5.4 ; Q3.4 109.5,44.43 C15.1 ; Q1.4 65.43,44.28 C1.1
  Top Layer w0.762: C7.1 46.86,35.19 U1.1 47.46,34.98 D1.2 47.61,37.8 C9.1 ; C23.1 135.25,35.62 U3.1 135.86,35.4 D5.2 136,38.22 141.48,43.7 141.48,46.99 134.75,53.72 127.76,53.72 ; 50.41,40.73 53.34,43.66 53.34,46.86 46.86,53.34 ; 90.93,53.34 97.41,46.86 97.41,43.68 C17.1 91.68,37.95 D3.2 91.54,35.12 U2.1 90.93,35.34 C16.1
  Top Layer w1.016: C38.1 28.61,17.43
  Top Layer w2.032: 101.22,53.34 146.3,53.34 154.7,44.94 156.01,44.94 ; 101.22,53.34 110.79,43.77 ; 101.22,53.34 58.66,53.34 ; 58.66,53.34 46.86,53.34 30.86,37.34 30.86,25.15 ; 58.66,53.34 67.48,44.52 ; U9.3 28.61,27.4 ; 28.61,27.4 30.86,25.15 ; 28.61,27.4 28.61,12.83 D7.1 ; 110.79,43.77 Q3.4 ; 110.79,43.77 111.68,44.67 C18.1 ; 29.34,24.64 29.6,24.37 C39.1 30.86,25.15 ; 156.01,44.94 Q5.4 ; 156.01,44.94 C25.1 ; C10.1 67.61,44.52 Q1.4
  Bottom Layer w2.032: U9.3 26.8,29.97 22.48,34.29 8.64,34.29 PWR_IN.2
HI_IN1: length 56.9
  Top Layer w0.508: H1.1 43.68,25.23 43.68,29.16 46.35,31.83 U1.2
  Bottom Layer w0.762: 46.73,31.83 46.65,31.75 44.45,31.75 40.64,27.94 40.64,17.4 33.15,9.91 24.77,9.91 DRV_IN.1
HI_IN2: length 87.4
  Top Layer w0.508: H2.1 87.76,25.38 87.76,29.31 90.42,31.98 U2.2
  Top Layer w0.762: DRV_IN.3 27.18,7.24 27.94,7.24 30.99,10.29 76.73,10.29 81.66,15.22 81.66,18.92 86.08,23.34 H2.1
HI_IN3: length 132.8
  Top Layer w0.762: DRV_IN.5 30.86,5.84 113.92,5.84 129.79,21.72 129.79,28.58 133.47,32.26 134.75,32.26 ; 134.75,32.26 132.08,29.59 132.08,25.65 H3.1 ; 134.75,32.26 U3.2
ISENSE1: length 98.3
  Top Layer w0.508: R7.1 77.6,20.51 78.11,20 78.11,18.74 U5.3 ; R7.1 75.69,21.02 ; R7.1 75.56,20.51 ; C12.1 58.33,36.4 57.27,36.4 v1(56.13,35.26) 53.71,37.67 C13.2
  Top Layer w0.762: 69.06,29.29 67.67,30.69 Q1.5 ; 67.16,29.29 65.13,31.32 Q1.3 ; Q1.2 63.86,30.76 65.33,29.29 ; Q1.6 68.94,31.01 70.35,29.6 70.35,29.29
  Top Layer w1.27: 72,27.64 72,24.19 R7.1 ; 72,27.64 72,31.25 70.94,32.31 Q1.7 ; 72,27.64 70.35,29.29 U1.6
  Top Layer w2.032: R7.1 70.75,15.57 Q2.4 65.55,14.62 58.88,14.62 58.82,14.69 R8.2
  Bottom Layer w0.508: H1.4 53.33,17.63 R8.2 ; U1.6 56.13,30.94 v1(56.13,35.26)
ISENSE2: length 98
  Top Layer w0.508: C20.2 97.79,37.82 v1(100.2,35.41) 101.35,36.55 102.4,36.55 C19.1 ; 119.76,21.17 R10.1 121.33,20.66 122.05,19.94 122.05,18.49 U4.3
  Top Layer w0.762: Q3.3 109.2,31.47 111.24,29.44 ; 114.43,29.44 113.01,30.85 Q3.6 ; Q3.2 107.93,30.88 109.37,29.44 ; 113.14,29.44 111.74,30.84 Q3.5
  Top Layer w1.27: 116.08,27.79 114.43,29.44 U2.6 ; 116.08,27.79 116.08,31.12 114.73,32.46 Q3.7 ; 116.08,27.79 116.08,24.34 R10.1
  Top Layer w2.032: R10.1 114.83,15.72 Q4.4 109.63,14.77 102.96,14.77 102.89,14.83 R11.2
  Bottom Layer w0.508: v1(100.2,35.41) 100.2,31.09 U2.6 ; H2.4 97.41,17.78 R11.2
ISENSE3: length 98.9
  Top Layer w0.508: 164.08,21.44 R13.1 164.23,21.08 165.74,21.08 166.5,20.32 166.5,18.87 165.6,17.97 ; C26.1 146.73,36.83 145.67,36.83 v1(144.53,35.68) 142.11,38.1 C27.2
  Top Layer w0.762: 154.31,29.72 152.26,31.77 Q5.2 ; Q5.3 153.53,31.75 155.56,29.72 ; Q5.6 157.34,31.13 158.75,29.72 ; Q5.5 156.07,31.11 157.46,29.72
  Top Layer w1.27: 160.4,28.06 160.4,24.62 R13.1 ; 160.4,28.06 158.75,29.72 U3.6 ; 160.4,28.06 160.4,30.23 158.61,32.02 Q5.7
  Top Layer w2.032: R14.2 147.22,15.11 147.28,15.05 153.95,15.05 Q6.4 159.15,16 R13.1
  Inner2 w0.508: R14.2 141.73,18.05 H3.4
  Bottom Layer w0.508: v1(144.53,35.68) 144.53,31.37 U3.6
ISENSE_AMP1: length 85.9
  Top Layer w0.762: v1(78.87,14.48) 78.87,16.82 78.93,16.88
  Inner2 w0.762: v1(78.87,14.48) 75.69,11.3 55.75,11.3 45.34,21.72 42.04,21.72 36.96,26.8 36.96,38.35 SenseOut.2
ISENSE_AMP2: length 129.4
  Top Layer w0.762: v1(123.95,19.94) 123.95,17.71 U4.1
  Inner2 w0.762: SenseOut.4 29.34,51.05 116.84,51.05 123.95,43.94 v1(123.95,19.94)
ISENSE_AMP3: length 171.4
  Top Layer w0.762: v1(168.53,18.16) 167.98,17.61 167.93,17.61 U6.1
  Inner2 w0.762: v1(168.53,18.16) 169.16,18.8 169.16,45.85 160.91,54.1 SenseOut.6
PHASE_OUT1: length 125.2
  Top Layer w0.508: v1(75.44,26.67) 75.47,26.64 75.56,26.64 ; U5.4 75.56,16.39 v1(75.06,16.89)
  Top Layer w2.032: v1(75.44,27.94) 75.44,29.49 75.43,29.49
  Bottom Layer w0.508: v1(75.06,16.89) 74.68,17.27 74.68,21.21 75.18,21.72
  Bottom Layer w2.032: v1(75.44,27.94) v1(75.44,26.67) 75.44,21.21 87.12,9.53 162.56,9.53 U10.1
PHASE_OUT2: length 78.6
  Top Layer w0.508: U4.4 119.19,16.89 v1(119.13,16.89)
  Top Layer w2.032: D4.2 119.76,29.51 v1(119.76,28.32) v1(119.76,26.8) R10.2
  Bottom Layer w0.508: v1(119.13,16.89) 117.86,18.16 117.86,24.89 v1(119.76,26.8)
  Bottom Layer w2.032: U10.2 150.24,30.35 144.4,24.51 144.4,23.37 142.11,21.08 133.22,21.08 125.98,28.32 v1(119.76,28.32)
PHASE_OUT3: length 31.3
  Top Layer w0.508: v1(163.96,27.05) 164.07,27.05 R13.2 ; U6.4 163.19,16.7 v1(163.19,16.89)
  Top Layer w2.032: U10.3 172.01,37.97 D6.2 164.08,29.79 R13.2
  Bottom Layer w0.508: v1(163.96,27.05) 161.42,24.51 161.42,18.42 162.94,16.89 v1(163.19,16.89)
SD#1: length 44
  Top Layer w0.508: H1.2 45.21,26.24 45.21,28.15 46.35,29.29 U1.3
  Bottom Layer w0.762: DRV_IN.2 25.22,7.82 33.99,7.82 48.13,21.96 48.13,23.19
SD#2: length 84.9
  Top Layer w0.508: H2.2 89.28,26.39 89.28,28.3 90.42,29.44 U2.3
  Top Layer w0.762: H2.2 92.33,23.24 90.55,21.46 86.49,21.46 83.44,18.42 83.44,14.35 77.22,8.13 30.61,8.13 DRV_IN.4
SD#3: length 123.3
  Top Layer w0.762: DRV_IN.6 113.41,3.81 131.32,21.72 135.25,21.72 136.65,23.11 H3.2 138.68,25.65 138.68,28.19 137.16,29.72 U3.3
VSENSE1: length 72.9
  Top Layer w0.508: 47.11,19.51 48.89,19.51 50.5,17.9 C14.2 ; 47.11,19.51 46.42,19.51 ; 47.11,19.51 H1.3 ; R9.2 46.42,19.51 ; 46.42,19.51 46.42,19.35 43.28,16.21 43.28,15.19
  Inner2 w0.762: R9.2 41.58,19.51 34.42,26.67 34.42,38.35 SenseOut.1
VSENSE2: length 114.9
  Top Layer w0.508: 91.19,19.66 90.49,19.66 ; 91.19,19.66 92.96,19.66 94.57,18.05 C21.2 ; 91.19,19.66 H2.3 ; 90.49,19.66 R12.2 ; 90.49,19.66 90.49,19.5 87.35,16.36 87.35,15.34
  Inner2 w0.762: SenseOut.3 28.7,49.15 74.68,49.15 80.64,43.18 80.64,26.24 R12.2
VSENSE3: length 156
  Top Layer w0.508: 135.51,19.94 137.29,19.94 138.9,18.33 C28.2 ; 135.51,19.94 H3.3 ; 135.51,19.94 134.82,19.94 ; 134.82,19.94 134.82,19.77 131.68,16.63 131.68,15.62 ; 134.82,19.94 R15.2
  Inner2 w0.762: SenseOut.5 30.35,52.58 119.13,52.58 126.75,44.96 126.75,24.74 R15.2
$1N695: length 3
  Top Layer w1.016: U1.7 RHS1.1
$1N696: length 2.4
  Top Layer w1.016: RHS1.2 62.1,31.83 Q1.1
$1N697: length 3.1
  Top Layer w1.016: U1.5 57.33,26.75 RLS1.1
$1N698: length 12.9
  Top Layer w0.508: Q2.1 70.35,26.53 70.35,25.23 69.08,23.96 63.01,23.96 RLS1.2
$1N719: length 15.3
  Top Layer w0.508: C13.1 51.87,38.39 54.29,40.81 C12.2 ; C13.1 51.87,36.98 U1.8 ; C13.1 51.74,37.8 D1.1
$1N1386: length 3
  Top Layer w1.016: U2.7 RHS2.1
$1N1387: length 2.4
  Top Layer w1.016: RHS2.2 106.18,31.98 Q3.1
$1N1388: length 3.1
  Top Layer w1.016: RLS2.1 101.41,26.9 U2.5
$1N1389: length 12.9
  Top Layer w0.508: RLS2.2 107.08,24.11 113.16,24.11 114.43,25.38 114.43,26.68 114.39,26.71
$1N1410: length 15.3
  Top Layer w0.508: U2.8 95.95,37.12 C20.1 ; C20.1 95.82,37.95 D3.1 ; C20.1 95.95,38.54 98.36,40.96 C19.2
$1N2077: length 3
  Top Layer w1.016: U3.7 RHS3.1
$1N2078: length 2.4
  Top Layer w1.016: Q5.1 150.5,32.26 RHS3.2
$1N2079: length 3.2
  Top Layer w1.016: RLS3.1 145.73,27.18 U3.5
$1N2080: length 12.9
  Top Layer w0.508: RLS3.2 151.41,24.38 157.48,24.38 158.75,25.65 158.75,26.96 Q6.1
$1N2101: length 15.3
  Top Layer w0.508: 140.27,38.1 140.14,38.22 D5.1 ; 140.27,38.1 140.27,37.4 U3.8 ; 140.27,38.1 140.27,38.82 142.69,41.23 C26.2
$1N11632: length 20.7
  Top Layer w1.016: 12.32,28.47 20.98,28.47 U9.1 ; 12.32,28.47 14.1,26.69 R17.1 ; 12.32,28.47 10.16,26.31 R16.2

## Copper pours and planes (outline as drawn; the poured copper is in the pictures)
+5V on +5V: 0.26,57.91 183.89,57.91 183.89,0.26 0.26,0.26
GND on GND: 0.26,57.91 183.89,57.91 183.89,0.26 0.26,0.26
(no net) on Top Layer: 15.11,58.17 0,43.05 0,16.38 16.38,0 171.32,0 184.15,12.83 184.15,49.15 175.13,58.17

Small or netless copper shapes (teardrops, artwork), in the pictures only: 52 on GND, 20 on +5V

## Text on the board
Bottom Silkscreen Layer: 3-Phase BLDC Motor Driver / Engineer: Pacheck Nicholas
Top Silkscreen Layer: 3-Phase BLDC Motor Driver / Engineer: Pacheck Nicholas | PhaseA | PhaseB | PhaseC

# Board PCB4_1
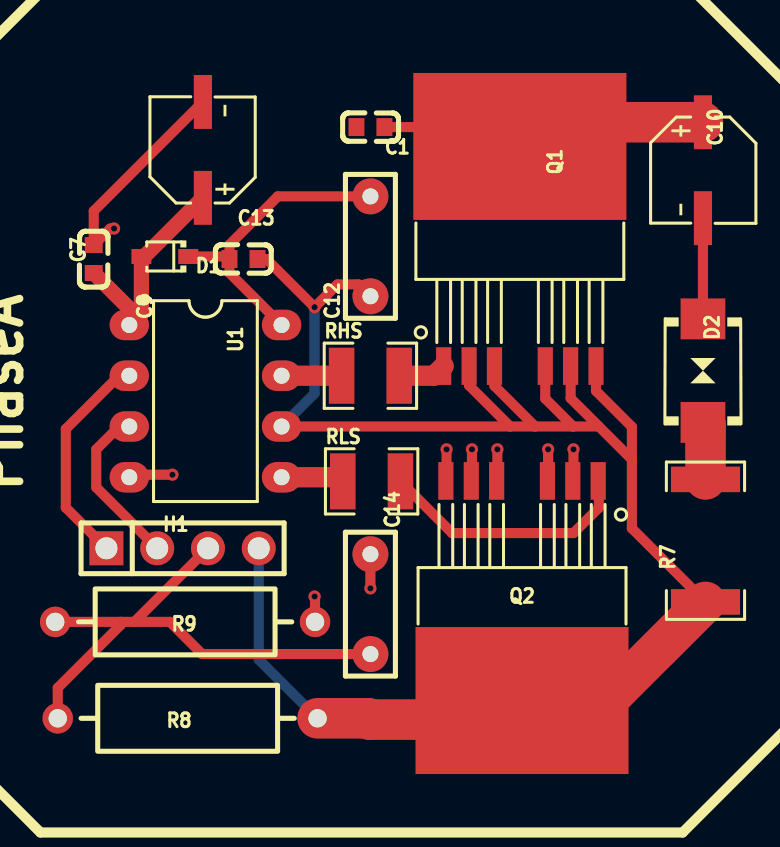
[diagram p4: board, top side]
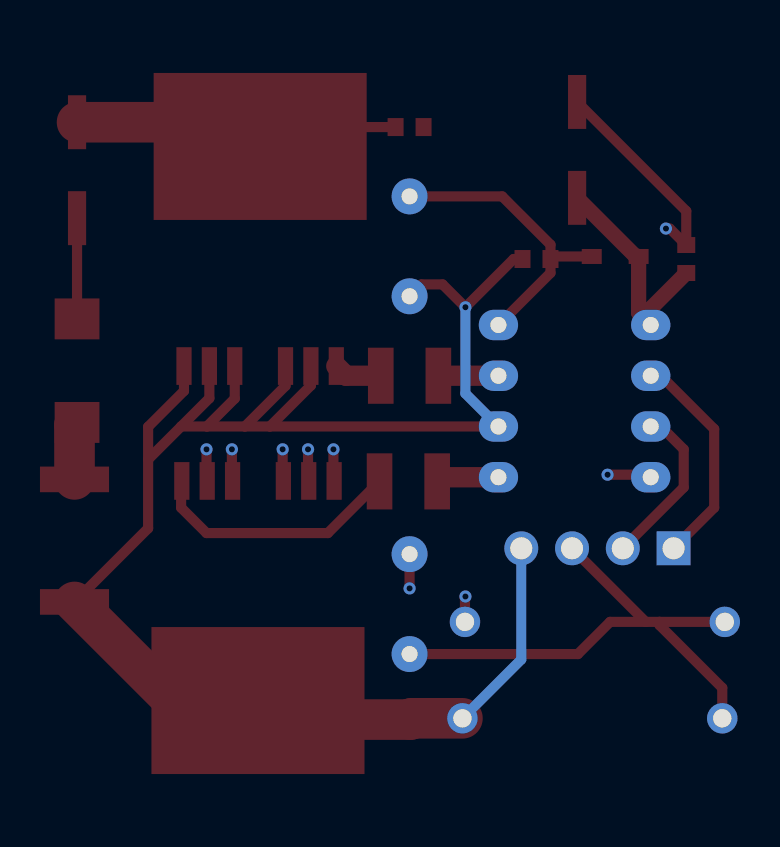
[diagram p5: board, bottom side, seen from below]

No outline. copper layers: Top Layer, Bottom Layer. Coordinates in mm from the lowest, leftmost part position.
Stack: Top Layer 0.035mm / Dielectric1 1.51mm FR4 er 4.5 / Bottom Layer 0.035mm

## Design rules (mm)
template: JLCPCB Capability(Two Layers Board)
spacing copperThickness1oz (default): track to track 0.102, other pairs 0.152 to 0.3
spacing copperThickness2oz: track to track 0.203, other pairs 0.152 to 0.3
track width copperThickness1oz (default): min 0.127, default 0.254, max 2.54
track width copperThickness2oz: min 0.203, default 0.254, max 2.54
differential pair differentialPair (default): width min 0.127, default 0.254, max 2.54; gap min 0.152, default 0.152
via viaSize (default): diameter min 0.5, default 0.61, max 10; hole min 0.3, default 0.305, max 6.3

## Placement (name value [footprint] x y rotation side)
C1  100nF  [C0603]  13.84 29.59 180 top
C7  100nF  [C0603]  0 22.99 90 top
C9  10uF  [CAP-SMD_BD5.0-L5.3-W5.3-LS6.3-FD]  5.46 28.45 90 top
C10  10uF  [CAP-SMD_BD5.0-L5.3-W5.3-LS6.3-FD]  30.48 27.43 270 top
C12  1uF  [CAP-TH_L7.2-W2.5-P5.00-D0.6]  13.84 23.62 90 top
C13  100nF  [C0603]  7.49 22.99 0 top
C14  1uF  [CAP-TH_L7.2-W2.5-P5.00-D0.6]  13.84 5.72 270 top
D1  1N5819WS  [SOD-323_L1.8-W1.3-LS2.5-RD]  3.56 23.11 180 top
D2  P6SMB6.8CA/TR13  [SMB_L4.6-W3.6-LS5.3-BI]  30.48 17.4 270 top
H1  -  [HDR-TH_4P-P2.54-V-M]  4.44 8.51 0 top
Q1  IRF2804STRL7PP  [D2PAK-7_L10.6-W9.6-P1.27-LS15.9-BR]  21.32 23.12 270 top
Q2  IRF2804STRL7PP  [D2PAK-7_L10.6-W9.6-P1.27-LS15.9-BR]  21.43 6.38 90 top
R7  5mΩ  [R2512]  30.61 8.89 90 top
R8  10kΩ  [RES-TH_BD3.3-L9.0-P13.00-D0.6]  4.7 0 0 top
R9  10kΩ  [RES-TH_BD3.3-L9.0-P13.00-D0.6]  4.57 4.83 180 top
RHS  10  [R1210]  13.84 17.14 0 top
RLS  10  [R1210]  13.9 11.86 0 top
U1  IR2104PBF  [DIP-8_L9.9-W6.6-P2.54-LS7.62-BL]  5.59 15.88 270 top

## Footprints (pads in the part's own frame, mm; a bottom-side part is the same pattern mirrored in y, then rotated)
C0603
  rect 0.8x0.9 smd: 1(-0.7,0) 2(0.7,0)
CAP-SMD_BD5.0-L5.3-W5.3-LS6.3-FD
  rect 2.7x0.91 smd: 1(-2.4,0) 2(2.4,0)
CAP-TH_L7.2-W2.5-P5.00-D0.6
  round 1.8 hole 0.8: 1(-2.499,0) 2(2.499,0)
D2PAK-7_L10.6-W9.6-P1.27-LS15.9-BR
  rect 1.887x0.762 smd: 1(5.495,-3.81) 2(5.495,-2.54) 3(5.495,-1.27) 5(5.495,1.27) 6(5.495,2.54) 7(5.495,3.81)
  rect 7.356x10.66 smd: 4(-5.495,0)
DIP-8_L9.9-W6.6-P2.54-LS7.62-BL
  oval 1.524x1.97 hole 0.8: 1(-3.81,-3.81) 2(-1.27,-3.81) 3(1.27,-3.81) 4(3.81,-3.81) 5(3.81,3.81) 6(1.27,3.81) 7(-1.27,3.81) 8(-3.81,3.81)
HDR-TH_4P-P2.54-V-M
  rect 1.7x1.7 hole 1.1: 1(-3.81,0)
  round 1.7 hole 1.1: 2(-1.27,0) 3(1.27,0) 4(3.81,0)
R1210
  rect 1.282x2.808 smd: 1(-1.441,0) 2(1.441,0)
R2512
  rect 1.282x3.456 smd: 1(-3.067,0) 2(3.067,0)
RES-TH_BD3.3-L9.0-P13.00-D0.6
  round 1.524 hole 0.914: 1(-6.5,0) 2(6.5,0)
SMB_L4.6-W3.6-LS5.3-BI
  rect 2.047x2.241 smd: 1(-2.591,0) 2(2.591,0)
SOD-323_L1.8-W1.3-LS2.5-RD
  rect 1x0.75 smd: 1(-1.173,0) 2(1.173,0)

## Nets
As in the schematic, except:
VCC: C1.1 C10.1 Q1.4
$1N2292: C7.1 C9.1 D1.2 U1.1

## Via types
v1: diameter 0.61, hole 0.305, Top Layer to Bottom Layer, 10 vias

## Routing (per net, layer and track width the routed paths; a pad name or vN(x,y) marks a point on that pad's centre or on a via; arc(x,y) is an arc through that point)
GND: length 29
  Top Layer w0.508: U1.4 1.91,12.19 v1(3.94,12.19) ; Q2.7 17.65,11.92 v1(17.65,13.46) ; Q2.6 18.92,11.92 v1(18.92,13.46) ; R9.1 11.07,6.07 v1(11.05,6.1) ; Q2.2 24,11.92 v1(24,13.46) ; v1(20.19,13.46) 20.19,11.92 Q2.5 ; v1(13.84,6.5) C14.1 ; D2.1 C10.2 ; C9.2 0,25.39 C7.2 0.82,24.51 v1(1.02,24.51) ; Q2.3 22.73,11.92 v1(22.73,13.46)
VCC: length 16.8
  Top Layer w0.508: C1.1 20.35,29.59 Q1.4
  Top Layer w2.032: Q1.4 22.53,29.83 C10.1
HI_IN: length 11.1
  Top Layer w0.508: H1.1 -1.4,10.54 -1.4,14.48 1.27,17.14 U1.2
ISENSE: length 93.4
  Top Layer w0.508: U1.6 20.83,14.61 ; 20.83,14.61 22.08,14.61 ; 20.83,14.61 18.78,16.66 Q1.2 ; 22.08,14.61 20.05,16.64 Q1.3 ; 22.08,14.61 23.99,14.61 ; 30.61,6.33 R7.1 26.92,9.51 26.92,12.95 ; C12.1 13.25,21.72 12.19,21.72 v1(11.05,20.57) 8.64,22.99 C13.2 ; 26.92,12.95 26.92,14.59 25.13,16.38 Q1.7 ; 26.92,12.95 25.27,14.61 ; 23.99,14.61 25.27,14.61 ; 23.99,14.61 22.59,16 Q1.5 ; 25.27,14.61 23.86,16.02 Q1.6
  Top Layer w2.032: R7.1 25.67,0.89 Q2.4 20.48,-0.06 13.8,-0.06 13.74,0 R8.2
  Bottom Layer w0.508: H1.4 8.25,2.94 R8.2 ; U1.6 11.05,16.26 v1(11.05,20.57)
PHASE_OUT: length 2.9
  Top Layer w2.032: R7.2 30.61,14.68 D2.2
SD#: length 8.3
  Top Layer w0.508: U1.3 1.27,14.61 0.13,13.46 0.13,11.56 H1.2
VSENSE: length 27.3
  Top Layer w0.508: -1.8,0.51 -1.8,1.52 1.34,4.66 1.34,4.83 ; 2.03,4.83 1.34,4.83 ; 2.03,4.83 H1.3 ; 2.03,4.83 3.81,4.83 5.42,3.22 C14.2 ; 1.34,4.83 R9.2
$1N697: length 3
  Top Layer w1.016: U1.7 RHS.1
$1N698: length 2.4
  Top Layer w1.016: RHS.2 17.03,17.14 Q1.1
$1N699: length 3.1
  Top Layer w1.016: U1.5 12.25,12.06 RLS.1
$1N700: length 12.9
  Top Layer w0.508: RLS.2 17.93,9.27 24,9.27 25.27,10.54 25.27,11.85 Q2.1
$1N2292: length 11.3
  Top Layer w0.762: C7.1 1.78,20.51 U1.1 2.38,20.29 D1.2 2.53,23.11 C9.1
$1N2600: length 15.3
  Top Layer w0.508: C13.1 6.67,23.11 D1.1 ; C13.1 6.79,23.71 9.21,26.12 C12.2 ; C13.1 6.79,22.29 U1.8

## Text on the board
Top Silkscreen Layer: PhaseA
